# Altium project PrintingProjectAllDocs.PrjPCB (part 2 of 3)

## Sheet MicMixer.SchDoc: Microphone Mixer
size B; CompanyName: Smart Home; DrawnBy: Levi Balling; Engineer: Levi Balling; Organization: U of U Computer Engineering; Address1: 50 S Central Campus Dr.; Address2: Rm. 3280 MEB; Address3: SLC, UT 84112; DocumentNumber: 1; Revision: 1; SheetNumber: 12; SheetTotal: 13; Website: www.eng.utah.edu/~lballing/SmartHome; Project: Smart Home; DocumentName: Mic Mixer; ProjectName: Smart Home
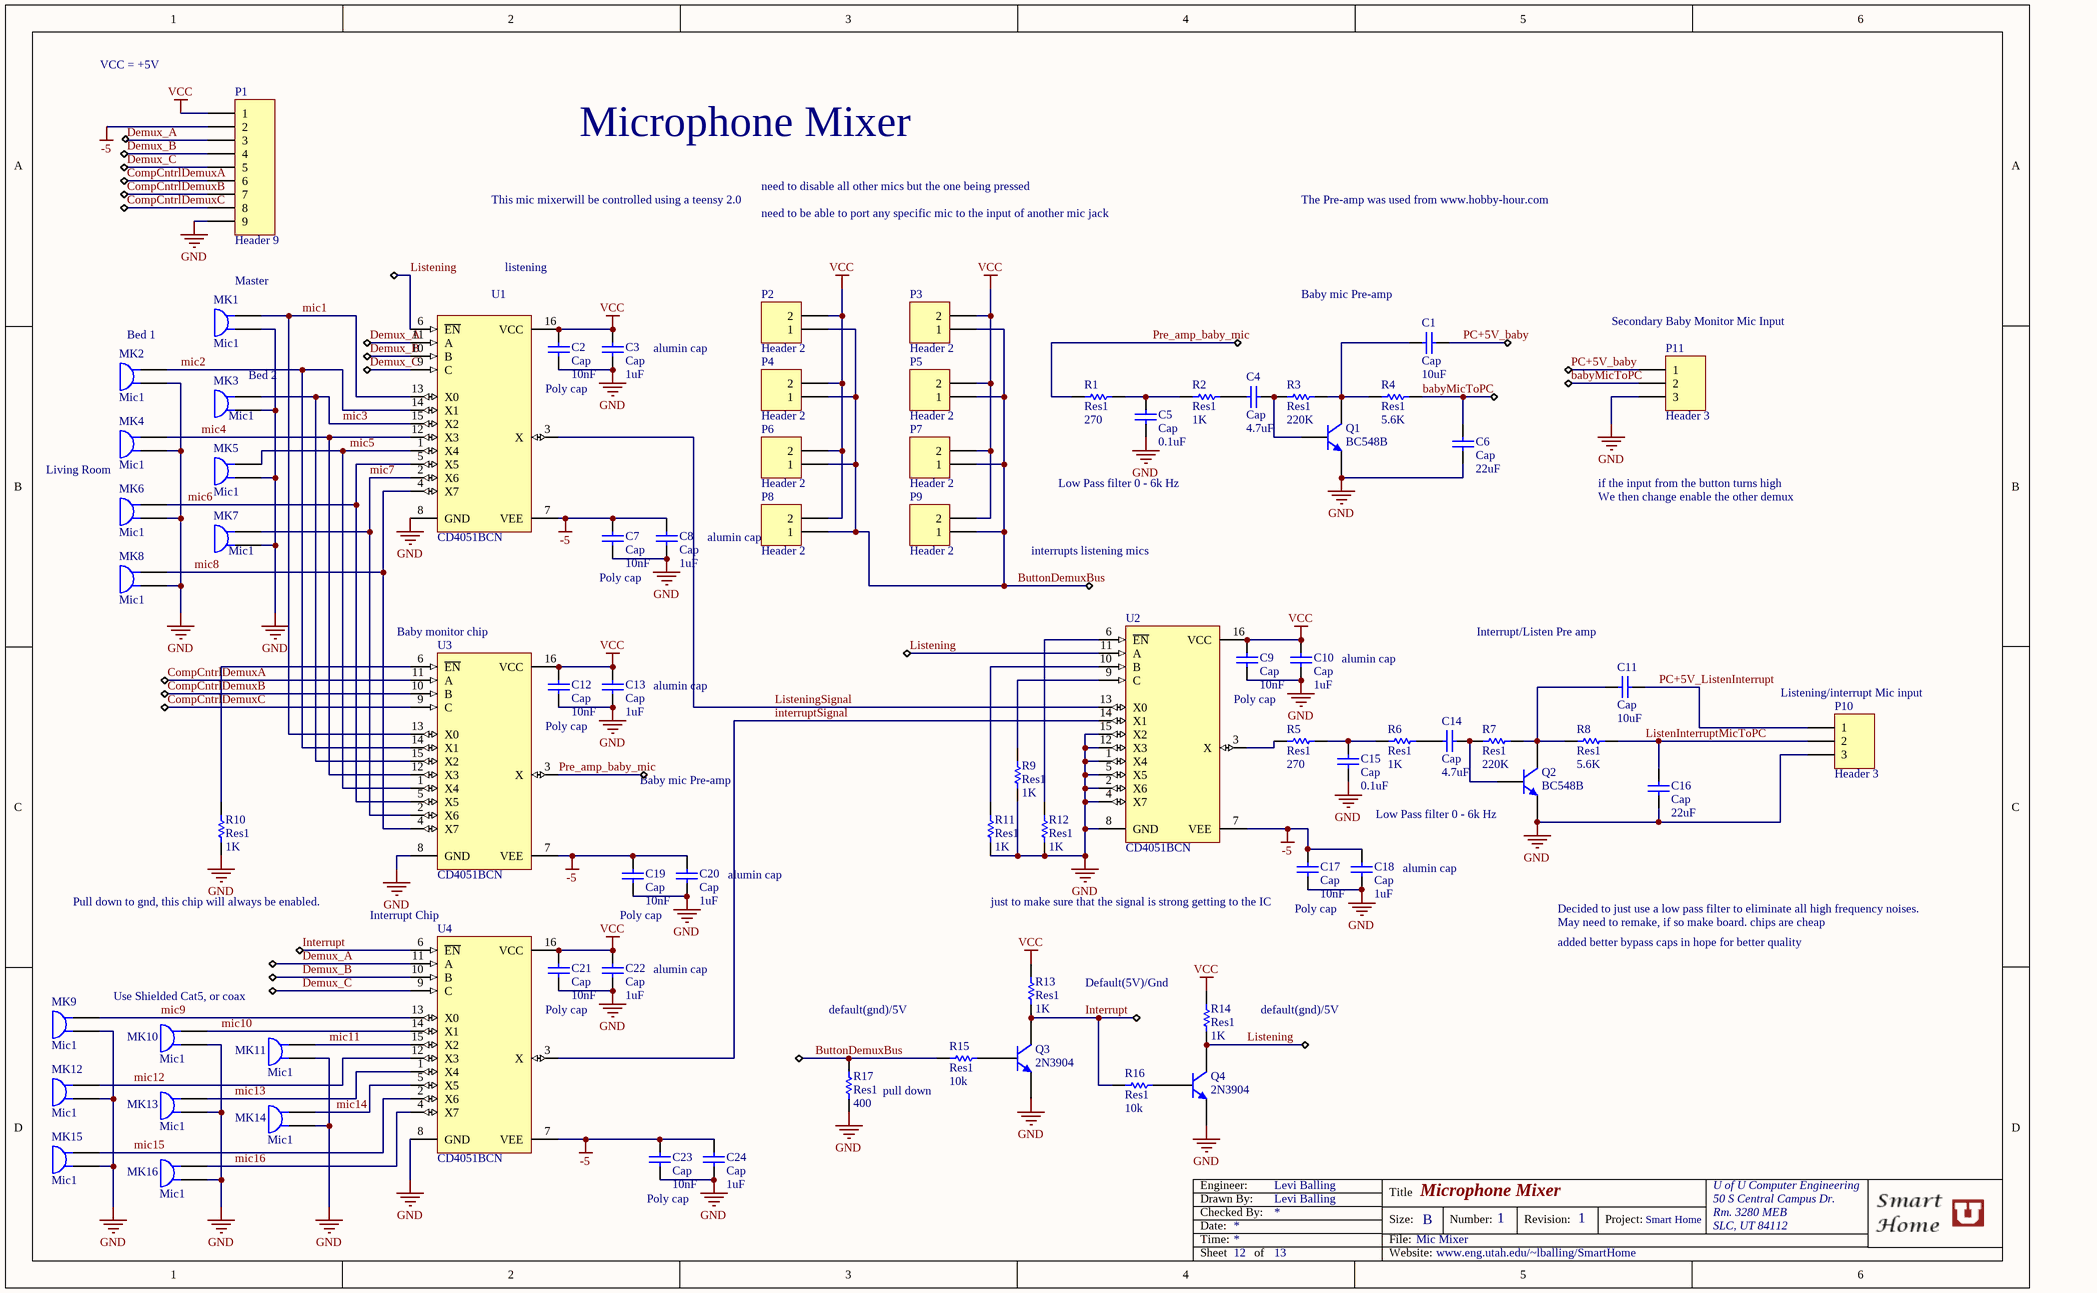
[diagram p5: MicMixer.SchDoc]

### Parts
(Parts that share a designator on the sheet are numbered #1, #2 ... from top to bottom, then left to right.)
C1#3  Cap  value 10uF  [RAD-0.2]
C2#3  Cap  value 10nF  [RAD-0.2]
C3#3  Cap  value 1uF  [RAD-0.2]
C4#3  Cap  value 4.7uF  [RAD-0.2]
C5#2  Cap  value 0.1uF  [RAD-0.2]
C6#2  Cap  value 22uF  [RAD-0.2]
C7#2  Cap  value 10nF  [RAD-0.2]
C8#2  Cap  value 1uF  [RAD-0.2]
C9#2  Cap  value 10nF  [RAD-0.2]
C10#1  Cap  value 1uF  [RAD-0.2]
C11#1  Cap  value 10uF  [RAD-0.2]
C12#1  Cap  value 10nF  [RAD-0.2]
C13#1  Cap  value 1uF  [RAD-0.2]
C14#1  Cap  value 4.7uF  [RAD-0.2]
C15#1  Cap  value 0.1uF  [RAD-0.2]
C16#1  Cap  value 22uF  [RAD-0.2]
C17#1  Cap  value 10nF  [RAD-0.2]
C18#1  Cap  value 1uF  [RAD-0.2]
C19#1  Cap  value 10nF  [RAD-0.2]
C20#1  Cap  value 1uF  [RAD-0.2]
C21#1  Cap  value 10nF  [RAD-0.2]
C22#1  Cap  value 1uF  [RAD-0.2]
C23#1  Cap  value 10nF  [RAD-0.2]
C24#1  Cap  value 1uF  [RAD-0.2]
MK1  Mic1  [PIN2]
MK2  Mic1  [PIN2]
MK3  Mic1  [PIN2]
MK4  Mic1  [PIN2]
MK5  Mic1  [PIN2]
MK6  Mic1  [PIN2]
MK7  Mic1  [PIN2]
MK8  Mic1  [PIN2]
MK9  Mic1  [PIN2]
MK10  Mic1  [PIN2]
MK11  Mic1  [PIN2]
MK12  Mic1  [PIN2]
MK13  Mic1  [PIN2]
MK14  Mic1  [PIN2]
MK15  Mic1  [PIN2]
MK16  Mic1  [PIN2]
P1#7  Header 9  [HDR1X9]
P2#9  Header 2  [HDR1X2]
P3#9  Header 2  [HDR1X2]
P4#7  Header 2  [HDR1X2]
P5#7  Header 2  [HDR1X2]
P6#4  Header 2  [HDR1X2]
P7#3  Header 2  [HDR1X2]
P8#2  Header 2  [HDR1X2]
P9#2  Header 2  [HDR1X2]
P10#3  Header 3  [HDR1X3]
P11#2  Header 3  [HDR1X3]
Q1#4  BC548B  [2N3904]
Q2#4  BC548B  [2N3904]
Q3#4  2N3904  [2N3904]
Q4#4  2N3904  [2N3904]
R1#4  Res1  value 270  [AXIAL-0.3]
R2#5  Res1  value 1K  [AXIAL-0.3]
R3#4  Res1  value 220K  [AXIAL-0.3]
R4#4  Res1  value 5.6K  [AXIAL-0.3]
R5#4  Res1  value 270  [AXIAL-0.3]
R6#3  Res1  value 1K  [AXIAL-0.3]
R7#3  Res1  value 220K  [AXIAL-0.3]
R8#3  Res1  value 5.6K  [AXIAL-0.3]
R9#3  Res1  value 1K  [AXIAL-0.3]
R10#3  Res1  value 1K  [AXIAL-0.3]
R11#3  Res1  value 1K  [AXIAL-0.3]
R12#3  Res1  value 1K  [AXIAL-0.3]
R13#3  Res1  value 1K  [AXIAL-0.3]
R14#3  Res1  value 1K  [AXIAL-0.3]
R15#3  Res1  value 10k  [AXIAL-0.3]
R16#3  Res1  value 10k  [AXIAL-0.3]
R17#3  Res1  value 400  [AXIAL-0.3]
U1#3  CD4051BCN  [N16E]
U2#3  CD4051BCN  [N16E]
U3#3  CD4051BCN  [N16E]
U4#3  CD4051BCN  [N16E]

### Nets
-5: C7#2.2 C8#2.2 C17#1.2 C18#1.2 C19#1.2 C20#1.2 C23#1.2 C24#1.2 P1#7.2 U1#3.7(VEE) U2#3.7(VEE) U3#3.7(VEE) U4#3.7(VEE)
GND: C2#3.1 C3#3.1 C5#2.2 C6#2.2 C7#2.1 C8#2.1 C9#2.1 C10#1.1 C12#1.1 C13#1.1 C15#1.2 C16#1.2 C17#1.1 C18#1.1 C19#1.1 C20#1.1 C21#1.1 C22#1.1 C23#1.1 C24#1.1 MK1.1 MK2.1 MK3.1 MK4.1 MK5.1 MK6.1 MK7.1 MK8.1 MK9.1 MK10.1 MK11.1 MK12.1 MK13.1 MK14.1 MK15.1 MK16.1 P1#7.9 P10#3.3 P11#2.3 Q1#4.1(E) Q2#4.1(E) Q3#4.1(E) Q4#4.1(E) R9#3.1 R10#3.1 R11#3.1 R12#3.1 R17#3.1 U1#3.8(GND) U2#3.1(X4) U2#3.2(X6) U2#3.4(X7) U2#3.5(X5) U2#3.8(GND) U2#3.12(X3) U2#3.15(X2) U3#3.8(GND) U4#3.8(GND)  [project net DampVCC12]
VCC: C2#3.2 C3#3.2 C9#2.2 C10#1.2 C12#1.2 C13#1.2 C21#1.2 C22#1.2 P1#7.1 P2#9.2 P3#9.2 P4#7.2 P5#7.2 P6#4.2 P7#3.2 P8#2.2 P9#2.2 R13#3.1 R14#3.1 U1#3.16(VCC) U2#3.16(VCC) U3#3.16(VCC) U4#3.16(VCC)
babyMicToPC: C6#2.1 P11#2.2 R4#4.2
ButtonDemuxBus: P2#9.1 P3#9.1 P4#7.1 P5#7.1 P6#4.1 P7#3.1 P8#2.1 P9#2.1 R15#3.2 R17#3.2
CompCntrlDemuxA: P1#7.6 U3#3.11(A)
CompCntrlDemuxB: P1#7.7 U3#3.10(B)
CompCntrlDemuxC: P1#7.8 U3#3.9(C)
Demux_A: P1#7.3 U1#3.11(A) U4#3.11(A)
Demux_B: P1#7.4 U1#3.10(B) U4#3.10(B)
Demux_C: P1#7.5 U1#3.9(C) U4#3.9(C)
Interrupt: Q3#4.3(C) R13#3.2 R16#3.2 U4#3.6(~{EN})
interruptSignal: U2#3.14(X1) U4#3.3(X)
Listening: Q4#4.3(C) R14#3.2 U1#3.6(~{EN}) U2#3.11(A)
ListeningSignal: U1#3.3(X) U2#3.13(X0)
ListenInterruptMicToPC: C16#1.1 P10#3.2 R8#3.2
mic1: MK1.2 U1#3.13(X0) U3#3.13(X0)
mic2: MK2.2 U1#3.14(X1) U3#3.14(X1)
mic3: MK3.2 U1#3.15(X2) U3#3.15(X2)
mic4: MK4.2 U1#3.12(X3) U3#3.12(X3)
mic5: MK5.2 U1#3.1(X4) U3#3.1(X4)
mic6: MK6.2 U1#3.5(X5) U3#3.5(X5)
mic7: MK7.2 U1#3.2(X6) U3#3.2(X6)
mic8: MK8.2 U1#3.4(X7) U3#3.4(X7)
mic9: MK9.2 U4#3.13(X0)
mic10: MK10.2 U4#3.14(X1)
mic11: MK11.2 U4#3.15(X2)
mic12: MK12.2 U4#3.12(X3)
mic13: MK13.2 U4#3.1(X4)
mic14: MK14.2 U4#3.5(X5)
mic15: MK15.2 U4#3.2(X6)
mic16: MK16.2 U4#3.4(X7)
PC+5V_baby: C1#3.2 P11#2.1
PC+5V_ListenInterrupt: C11#1.2 P10#3.1
Pre_amp_baby_mic: R1#4.1 U3#3.3(X)
NetC1#3_1: C1#3.1 Q1#4.3(C) R3#4.2 R4#4.1
NetC4#3_1: C4#3.1 Q1#4.2(B) R3#4.1
NetC4#3_2: C4#3.2 R2#5.2
NetC5#2_1: C5#2.1 R1#4.2 R2#5.1
NetC11#1_1: C11#1.1 Q2#4.3(C) R7#3.2 R8#3.1
NetC14#1_1: C14#1.1 Q2#4.2(B) R7#3.1
NetC14#1_2: C14#1.2 R6#3.2
NetC15#1_1: C15#1.1 R5#4.2 R6#3.1
NetQ3#4_2: Q3#4.2(B) R15#3.1
NetQ4#4_2: Q4#4.2(B) R16#3.1
NetR5#4_1: R5#4.1 U2#3.3(X)
NetR9#3_2: R9#3.2 U2#3.9(C)
NetR10#3_2: R10#3.2 U3#3.6(~{EN})
NetR11#3_2: R11#3.2 U2#3.10(B)
NetR12#3_2: R12#3.2 U2#3.6(~{EN})

### Notes on the sheet
- VCC = +5V
- This mic mixerwill be controlled using a teensy 2.0
- need to disable all other mics but the one being pressed
- need to be able to port any specific mic to the input of another mic jack
- The Pre-amp was used from www.hobby-hour.com
- (near MK1) Master
- listening
- (near C1#3) Baby mic Pre-amp
- (near MK2) Bed 1
- (near C3#3) alumin cap
- (near P11#2) Secondary Baby Monitor Mic Input
- (near MK3) Bed 2
- (near U1#3) Poly cap
- Living Room
- Low Pass filter 0 - 6k Hz
- if the input from the button turns high
- We then change enable the other demux
- alumin cap
- interrupts listening mics
- (near U3#3) Baby monitor chip
- Poly cap
- (near C11#1) Interrupt/Listen Pre amp
- (near C13#1) alumin cap
- (near U2#3) Poly cap
- (near C10#1) alumin cap
- (near P10#3) Listening/interrupt Mic input
- (near U3#3) Poly cap
- Baby mic Pre-amp
- (near Q2#4) Low Pass filter 0 - 6k Hz
- Pull down to gnd, this chip will always be enabled.
- (near C20#1) alumin cap
- just to make sure that the signal is strong getting to the IC
- (near C18#1) alumin cap
- Decided to just use a low pass filter to eliminate all high frequency noises.
- (near U4#3) Interrupt Chip
- (near C22#1) alumin cap
- May need to remake, if so make board. chips are cheap
- added better bypass caps in hope for better quality
- Use Shielded Cat5, or coax
- (near U4#3) Poly cap
- default(gnd)/5V
- (near R14#3) Default(5V)/Gnd
- pull down
- Date:
- Time:
- Engineer:
- Drawn By:
- Checked By:
- Title
- Size:
- File:
- B
- Number:
- Revision:
- Project:
- Sheet
- of
- Website:

### Library data of the parts
C1#3 C2#3 C3#3 C4#3 C5#2 C6#2 C7#2 C8#2 C9#2 C10#1 C11#1 C12#1 C13#1 C14#1 C15#1 C16#1 C17#1 C18#1 C19#1 C20#1 C21#1 C22#1 C23#1 C24#1 = Cap: Capacitor; Vendor: Taydaelectronics; Published: 8-Jun-2000; LatestRevisionDate: 17-Jul-2002; LatestRevisionNote: Re-released for DXP Platform.; PackageReference: RAD-0.3; Publisher: Altium Limited; PackageDescription: Radial Cap, Thru-Hole; 2 Leads; 0.3 in Pin Spacing
  C1#3 C3#3 C4#3 C5#2 C6#2 C8#2 C10#1 C11#1 C13#1 C14#1 C15#1 C16#1 C18#1 C20#1 C22#1 C24#1: Price: 0.03
  C2#3 C7#2 C9#2 C12#1 C17#1 C19#1 C21#1 C23#1: Price: 0.04
MK1-MK16 = Mic1: Microphone; Vendor: Taydaelectronics; Published: 24-Mar-1999; LatestRevisionDate: 17-Jul-2002; LatestRevisionNote: Re-released for DXP Platform.; PackageReference: PIN2; Publisher: Altium Limited; Price: 0.25; Value: Mic1
P1#7 = Header 9: Header, 9-Pin; Vendor: Taydaelectronics; LatestRevisionDate: 17-Jul-2002; LatestRevisionNote: Re-released for DXP Platform.; Publisher: Altium Limited; Price: 0.09; Value: Header 9
P2#9 P3#9 P4#7 P5#7 P6#4 P7#3 P8#2 P9#2 = Header 2: Header, 2-Pin; Vendor: Taydaelectronics; LatestRevisionDate: 17-Jul-2002; LatestRevisionNote: Re-released for DXP Platform.; Publisher: Altium Limited; Price: 0.02; Value: Header 2
P10#3 P11#2 = Header 3: Header, 3-Pin; Vendor: Taydaelectronics; LatestRevisionDate: 17-Jul-2002; LatestRevisionNote: Re-released for DXP Platform.; Publisher: Altium Limited; Price: 0.03; Value: Header 3
Q1#4 Q2#4 Q3#4 Q4#4 = 2N3904: as Q1#1 on sheet DamperSection; Published: 8-Jun-2000; LatestRevisionDate: 15-Jan-2003; LatestRevisionNote: PCB Footprint 'BCY-W3/D4.7' replaced; DatasheetVersion: 1997; PackageVersion: Sep-1998; PackageReference: TO-92A; Publisher: Altium Limited; PackageDescription: TO, Flat Index; 3 In-Line, Axial Leads; Body Dia. 4.5mm; Leads 0.51 x 0.48 mm (max); ComponentLink1URL: http://www.fairchildsemi.com/; ComponentLink2Description: Datasheet; ComponentLink2URL: http://www.fairchildsemi.com/ds/2N%2F2N3904.pdf; Price: 0.01
  Q1#4 Q2#4: Value: BC548B
  Q3#4 Q4#4: Value: 2N3904
R1#4 R2#5 R3#4 R4#4 R5#4 R6#3 R7#3 R8#3 R9#3 R10#3 R11#3 R12#3 R13#3 R14#3 R15#3 R16#3 R17#3 = Res1: Resistor; Vendor: Taydaelectronics; Published: 8-Jun-2000; LatestRevisionDate: 17-Jul-2002; LatestRevisionNote: Re-released for DXP Platform.; PackageReference: AXIAL-0.3; Publisher: Altium Limited; PackageDescription: Axial Device, Thru-Hole; 2 Leads; 0.3 in Pin Spacing; Price: 0.01
U1#3 U2#3 U3#3 U4#3 = CD4051BCN: 8-Channel Analog Multiplexer/Demultiplexer; Vendor: Taydaelectronics; Published: 17-Jul-2002; LatestRevisionDate: 29-May-2009; LatestRevisionNote: Component Body Added.; DatasheetVersion: Jan-1999; PackageVersion: 2000; PackageReference: N16E; Publisher: Altium Limited; PackageDescription: DIP, 16-Pin, Row Spacing 7.62 mm, Pitch 2.54 mm; ComponentLink1URL: http://www.fairchildsemi.com/; ComponentLink2Description: Datasheet; ComponentLink2URL: http://www.fairchildsemi.com/ds/CD%2FCD4052BC.pdf; Price: 0.23; Value: CD4051BCN

## Sheet MotorController.SchDoc: Bi-Polar Stepper Motor Driver
size B; Date: 7/13/2012; ApprovedBy: Levi Balling; CheckedBy: Dell Hanks; Author: Rob Paisley; CompanyName: Smart Home; DrawnBy: Levi Balling; Engineer: R. Paisley, L. Balling; Organization: U of U Computer Engineering; Address1: 50 S Central Campus Dr.; Address2: Rm. 3280 MEB; Address3: SLC,UT 84112; DocumentNumber: 1; Revision: 1; SheetNumber: 7; SheetTotal: 13; Project: Smart Home; Website: www.eng.utah.edu/~lballing/SmartHome; Description: This Board will control the bi-polar stepper motor with a range of 0.5 to 5 amps (provided you put heat sinks on); CurrentTime: 6:23PM; CurrentDate: 7/13/2012; DocumentName: Bi-Polar Stepper Motor Driver; ProjectName: Smart Home
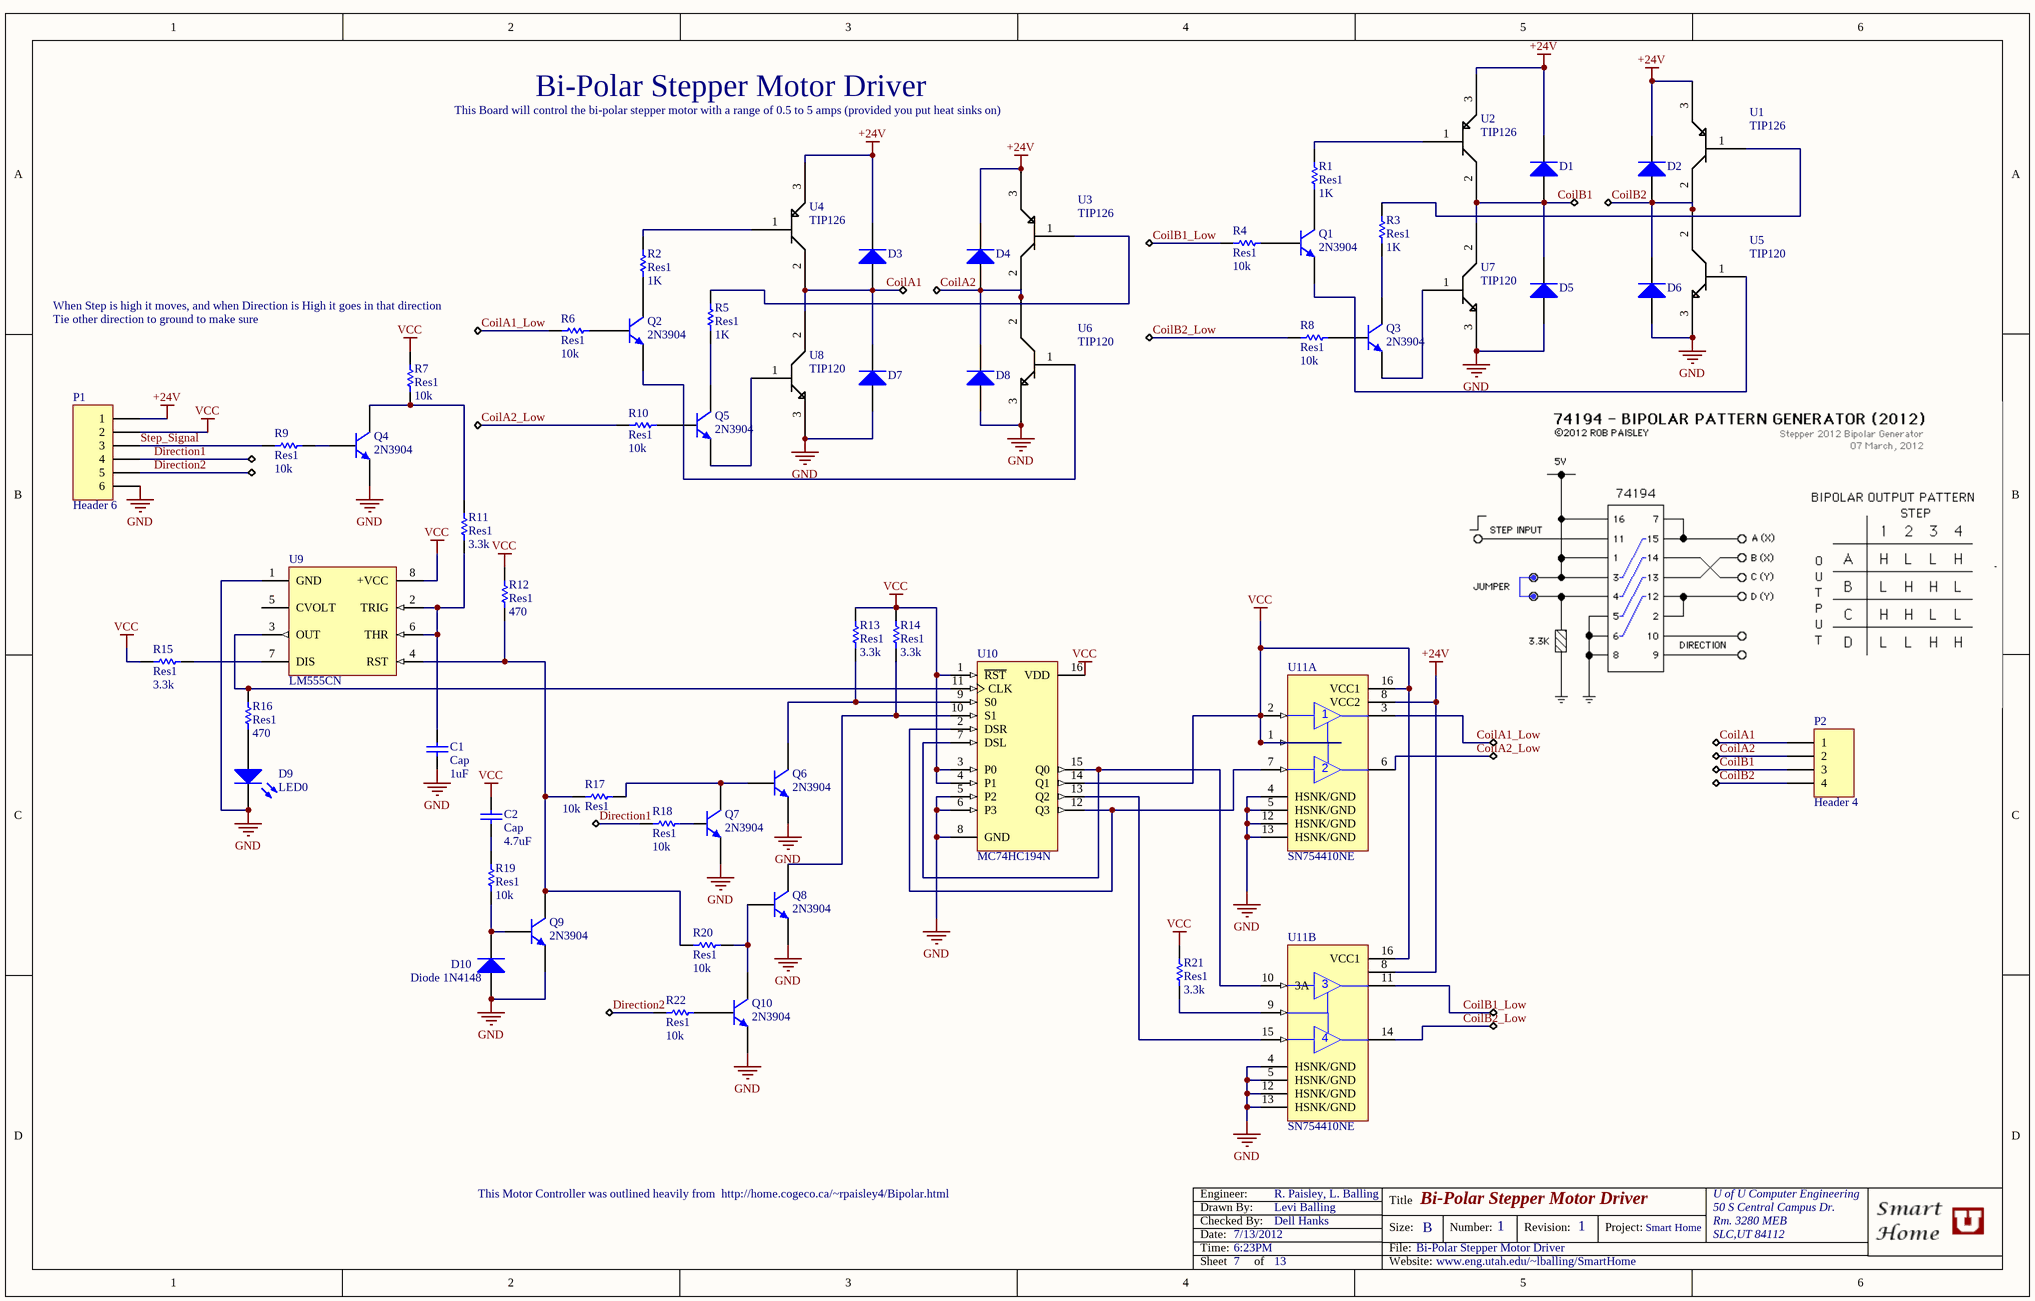
[diagram p6: MotorController.SchDoc]

### Parts
(Parts that share a designator on the sheet are numbered #1, #2 ... from top to bottom, then left to right.)
C1#4  Cap  value 1uF  [RAD-0.3]
C2#4  Cap  value 4.7uF  [RAD-0.3]
D1#4  Diode 1N5408  [DO-201AD]  (value not drawn)
D2#5  Diode 1N5408  [DO-201AD]  (value not drawn)
D3#4  Diode 1N5408  [DO-201AD]  (value not drawn)
D4#4  Diode 1N5408  [DO-201AD]  (value not drawn)
D5#4  Diode 1N5408  [DO-201AD]  (value not drawn)
D6#4  Diode 1N5408  [DO-201AD]  (value not drawn)
D7#4  Diode 1N5408  [DO-201AD]  (value not drawn)
D8#3  Diode 1N5408  [DO-201AD]  (value not drawn)
D9#2  LED0  [LED-0]
D10#2  Diode 1N4148  [DO-35]
P1#8  Header 6  [HDR1X6]
P2#10  Header 4  [HDR1X4]
Q1#5  2N3904  [2N3904]
Q2#5  2N3904  [2N3904]
Q3#5  2N3904  [2N3904]
Q4#5  2N3904  [2N3904]
Q5#4  2N3904  [2N3904]
Q6#3  2N3904  [2N3904]
Q7#3  2N3904  [2N3904]
Q8#2  2N3904  [2N3904]
Q9#2  2N3904  [2N3904]
Q10#2  2N3904  [2N3904]
R1#5  Res1  value 1K  [AXIAL-0.3]
R2#6  Res1  value 1K  [AXIAL-0.3]
R3#5  Res1  value 1K  [AXIAL-0.3]
R4#5  Res1  value 10k  [AXIAL-0.3]
R5#5  Res1  value 1K  [AXIAL-0.3]
R6#4  Res1  value 10k  [AXIAL-0.3]
R7#4  Res1  value 10k  [AXIAL-0.3]
R8#4  Res1  value 10k  [AXIAL-0.3]
R9#4  Res1  value 10k  [AXIAL-0.3]
R10#4  Res1  value 10k  [AXIAL-0.3]
R11#4  Res1  value 3.3k  [AXIAL-0.3]
R12#4  Res1  value 470  [AXIAL-0.3]
R13#4  Res1  value 3.3k  [AXIAL-0.3]
R14#4  Res1  value 3.3k  [AXIAL-0.3]
R15#4  Res1  value 3.3k  [AXIAL-0.3]
R16#4  Res1  value 470  [AXIAL-0.3]
R17#4  Res1  value 10k  [AXIAL-0.3]
R18#3  Res1  value 10k  [AXIAL-0.3]
R19#3  Res1  value 10k  [AXIAL-0.3]
R20#3  Res1  value 10k  [AXIAL-0.3]
R21#3  Res1  value 3.3k  [AXIAL-0.3]
R22#3  Res1  value 10k  [AXIAL-0.3]
U1#4  TIP126  [TO-220]
U2#4  TIP126  [TO-220]
U3#4  TIP126  [TO-220]
U4#4  TIP126  [TO-220]
U5#2  TIP120  [TO-220]
U6#1  TIP120  [TO-220]
U7  TIP120  [TO-220]
U8  TIP120  [TO-220]
U9  LM555CN  [N08E]
U10  MC74HC194N  [648-06]
U11  SN754410NE  [NE016]  (parts A,B of 2)

### Nets
+24V: D1#4.2(K) D2#5.2(K) D3#4.2(K) D4#4.2(K) P1#8.1 U1#4.3 U2#4.3 U3#4.3 U4#4.3 U11.8(VCC2)
GND: C1#4.2 D5#4.1(A) D6#4.1(A) D7#4.1(A) D8#3.1(A) D9#2.2(K) D10#2.1(A) P1#8.6 Q4#5.1(E) Q6#3.1(E) Q7#3.1(E) Q8#2.1(E) Q9#2.1(E) Q10#2.1(E) U5#2.3 U6#1.3 U7.3 U8.3 U9.1(GND) U10.5(P2) U10.6(P3) U10.8(GND) U11.4(HSNK/GND) U11.5(HSNK/GND) U11.12(HSNK/GND) U11.13(HSNK/GND)  [project net DampVCC12]
VCC: C2#4.1 P1#8.2 R7#4.2 R12#4.1 R13#4.1 R14#4.1 R15#4.2 R21#3.1 U9.8(+VCC) U10.1(~{RST}) U10.3(P0) U10.4(P1) U10.14(Q1) U10.16(VDD) U11.1(1,2EN) U11.2(1A) U11.16(VCC1)
CoilA1: D3#4.1(A) D7#4.2(K) P2#10.1 U4#4.2 U8.2
CoilA1_Low: R6#4.1 U11.3(1Y)
CoilA2: D4#4.1(A) D8#3.2(K) P2#10.2 U3#4.2 U6#1.2
CoilA2_Low: R10#4.1 U11.6(2Y)
CoilB1: D1#4.1(A) D5#4.2(K) P2#10.3 U2#4.2 U7.2
CoilB1_Low: R4#5.1 U11.11(3Y)
CoilB2: D2#5.1(A) D6#4.2(K) P2#10.4 U1#4.2 U5#2.2
CoilB2_Low: R8#4.1 U11.14(4Y)
Direction1: P1#8.4 R18#3.2
Direction2: P1#8.5 R22#3.2
Step_Signal: P1#8.3 R9#4.2
NetC1#4_1: C1#4.1 R11#4.1 U9.2(TRIG) U9.6(THR)
NetC2#4_2: C2#4.2 R19#3.1
NetD9#2_1: D9#2.1(A) R16#4.2
NetD10#2_2: D10#2.2(K) Q9#2.2(B) R19#3.2
NetQ1#5_1: Q1#5.1(E) U5#2.1
NetQ1#5_2: Q1#5.2(B) R4#5.2
NetQ1#5_3: Q1#5.3(C) R1#5.1
NetQ2#5_1: Q2#5.1(E) U6#1.1
NetQ2#5_2: Q2#5.2(B) R6#4.2
NetQ2#5_3: Q2#5.3(C) R2#6.1
NetQ3#5_1: Q3#5.1(E) U7.1
NetQ3#5_2: Q3#5.2(B) R8#4.2
NetQ3#5_3: Q3#5.3(C) R3#5.1
NetQ4#5_2: Q4#5.2(B) R9#4.1
NetQ4#5_3: Q4#5.3(C) R7#4.1 R11#4.2
NetQ5#4_1: Q5#4.1(E) U8.1
NetQ5#4_2: Q5#4.2(B) R10#4.2
NetQ5#4_3: Q5#4.3(C) R5#5.1
NetQ6#3_2: Q6#3.2(B) Q7#3.3(C) R17#4.2
NetQ6#3_3: Q6#3.3(C) R13#4.2 U10.9(S0)
NetQ7#3_2: Q7#3.2(B) R18#3.1
NetQ8#2_2: Q8#2.2(B) Q10#2.3(C) R20#3.2
NetQ8#2_3: Q8#2.3(C) R14#4.2 U10.10(S1)
NetQ9#2_3: Q9#2.3(C) R12#4.2 R17#4.1 R20#3.1 U9.4(RST)
NetQ10#2_2: Q10#2.2(B) R22#3.1
NetR1#5_2: R1#5.2 U2#4.1
NetR2#6_2: R2#6.2 U4#4.1
NetR3#5_2: R3#5.2 U1#4.1
NetR5#5_2: R5#5.2 U3#4.1
NetR15#4_1: R15#4.1 U9.7(DIS)
NetR16#4_1: R16#4.1 U9.3(OUT) U10.11(CLK)
NetR21#3_2: R21#3.2 U11.9(3,4EN)
NetU10_2: U10.2(DSR) U10.12(Q3) U11.7(2A)
NetU10_7: U10.7(DSL) U10.15(Q0) U11.10(3A)
NetU10_13: U10.13(Q2) U11.15(4A)

Not connected (* = marked no-connect by the designer): U9 5(CVOLT)

### Notes on the sheet
- (near R6#4) When Step is high it moves, and when Direction is High it goes in that direction
- Tie other direction to ground to make sure
- This Motor Controller was outlined heavily from  http://home.cogeco.ca/~rpaisley4/Bipolar.html
- Date:
- Time:
- Engineer:
- Drawn By:
- Checked By:
- Title
- Size:
- File:
- B
- Number:
- Revision:
- Project:
- Sheet
- of
- Website:

### Library data of the parts
C1#4 C2#4 = Cap: Capacitor; Vendor: Taydaelectronics; Published: 8-Jun-2000; LatestRevisionDate: 17-Jul-2002; LatestRevisionNote: Re-released for DXP Platform.; PackageReference: RAD-0.3; Publisher: Altium Limited; PackageDescription: Radial Cap, Thru-Hole; 2 Leads; 0.3 in Pin Spacing; Price: 0.03
D1#4 D2#5 D3#4 D4#4 D5#4 D6#4 D7#4 D8#3 = Diode 1N5408: 3 Amp Medium Power Silicon Rectifier Diode; Vendor: Taydaelectronics; Published: 8-Jun-2000; LatestRevisionDate: 17-Jul-2002; LatestRevisionNote: Re-released for DXP Platform.; DatasheetVersion: Aug-1984; PackageReference: DO-201AD; Publisher: Altium Limited; PackageDescription: Diode, Axial; Body 9.5 x 5.3 mm (LxDia. max), Lead Dia. 1.32 mm (max); ComponentLink1URL: http://www.irf.com/; Price: 0.03; Value: Diode 1N5408
D9#2 = LED0: Typical INFRARED GaAs LED; Vendor: Taydaelectronics; Published: 8-Jun-2000; LatestRevisionDate: 08-Jul-2005; LatestRevisionNote: Mech Layer 1 removed.; PackageReference: LED-0; Publisher: Altium Limited; PackageDescription: LED; 2 Leads; Price: 0.04; Value: LED0
D10#2 = Diode 1N4148: High Conductance Fast Diode; Vendor: Taydaelectronics; Published: 8-Jun-2000; LatestRevisionDate: 17-Jul-2002; LatestRevisionNote: Re-released for DXP Platform.; DatasheetVersion: 1997; PackageReference: DO-35; Publisher: Altium Limited; PackageDescription: Diode, Axial; Body 3.8 x 1.9 mm (LxDia. max), Lead Dia. 0.53 mm (max); Code_JEDEC: DO-204-AH; ComponentLink1URL: http://www.fairchildsemi.com/; ComponentLink2Description: Datasheet; ComponentLink2URL: http://www.fairchildsemi.com/ds/1N%2F1N4148.pdf; Price: 0.01; Value: Diode 1N4148
P1#8 = Header 6: Header, 6-Pin; Vendor: Taydaelectronics; LatestRevisionDate: 17-Jul-2002; LatestRevisionNote: Re-released for DXP Platform.; Publisher: Altium Limited; Price: 0.06; Value: Header 6
P2#10 = Header 4: Header, 4-Pin; Vendor: Taydaelectronics; LatestRevisionDate: 17-Jul-2002; LatestRevisionNote: Re-released for DXP Platform.; Publisher: Altium Limited; Price: 0.04; Value: Header 4
Q1#5 Q2#5 Q3#5 Q4#5 Q5#4 Q6#3 Q7#3 Q8#2 Q9#2 Q10#2 = 2N3904: as Q1#1 on sheet DamperSection; Published: 8-Jun-2000; LatestRevisionDate: 15-Jan-2003; LatestRevisionNote: PCB Footprint 'BCY-W3/D4.7' replaced; DatasheetVersion: 1997; PackageVersion: Sep-1998; PackageReference: TO-92A; Publisher: Altium Limited; PackageDescription: TO, Flat Index; 3 In-Line, Axial Leads; Body Dia. 4.5mm; Leads 0.51 x 0.48 mm (max); ComponentLink1URL: http://www.fairchildsemi.com/; ComponentLink2Description: Datasheet; ComponentLink2URL: http://www.fairchildsemi.com/ds/2N%2F2N3904.pdf; Price: 0.01; Value: 2N3904
R1#5 R2#6 R3#5 R4#5 R5#5 R6#4 R7#4 R8#4 R9#4 R10#4 R11#4 R12#4 R13#4 R14#4 R15#4 R16#4 R17#4 R18#3 R19#3 R20#3 R21#3 R22#3 = Res1: Resistor; Vendor: Taydaelectronics; Published: 8-Jun-2000; LatestRevisionDate: 17-Jul-2002; LatestRevisionNote: Re-released for DXP Platform.; PackageReference: AXIAL-0.3; Publisher: Altium Limited; PackageDescription: Axial Device, Thru-Hole; 2 Leads; 0.3 in Pin Spacing; Price: 0.01
U1#4 U2#4 U3#4 U4#4 = TIP126: TIP126 -PNP; Vendor: Taydaelectronics; Price: 0.35; Value: TIP126
U5#2 U6#1 U7 U8 = TIP120: NPN 60V -5A TO-220; Vendor: Taydaelectronics; Price: 0.26; Value: TIP120
U9 = LM555CN: Timer; Manufacturer: National Semiconductor; CompType: Analog IC; PackageTopMarking: NSUZXYTT*LM*555CN; PowerWise: N; Vendor: Taydaelectronics; Published: 4-Dec-2008; DatasheetVersion: Jul-2006; PackageVersion: revG, May-2006; PackageReference: N08E; Publisher: Altium Limited; PackageDescription: MDIP, .365 x .250 x .130in, 8 Lead, .100in Pitch; PartNumber: LM555CN; PinCount: 8; DigiKeyPartNumber: LM555CNNS-ND; Code_JEDEC: MS-001-BA; ComponentLink1URL: http://www.national.com/ds.cgi/LM/LM555.pdf; ComponentLink2Description: LM555 Web Page; ComponentLink2URL: http://www.national.com/pf/LM/LM555.html; ComponentLink3Description: N08E package page; ComponentLink3URL: http://www.national.com/packaging/folders/n08e.html; Price: 0.14; Value: LM555CN
U10 = MC74HC194N: 4-Bit Bidirectional Universal Shift Register; Vendor: Digi-Key; Published: 17-Jul-2002; LatestRevisionDate: 06-Jun-2005; LatestRevisionNote: Stylized 3D Model Added; DatasheetVersion: 1989; PackageReference: 648-06; Publisher: Altium Limited; PackageDescription: DIP; 16 Leads; Row Spacing 7.62 mm; Pitch 2.54 mm; ComponentLink1URL: http://www.onsemi.com/site/products/parametrics/0,4446,557,00.html; Price: 0.68; Value: MC74HC194N
U11 = SN754410NE: Quadruple Half-H Driver; Vendor: U of U; Published: 15-May-2002; LatestRevisionDate: 29-May-2009; LatestRevisionNote: Component Body Added.; DatasheetVersion: May-1990; PackageVersion: 1991; PackageReference: NE016; Publisher: Altium Limited; PackageDescription: DIP, 16-Pin, Row Spacing 7.62 mm, Pitch 2.54 mm; Code_JEDEC: MS-001-BB; ComponentLink1URL: http://www.ti.com/; ComponentLink2Description: Datasheet; ComponentLink2URL: http://www-s.ti.com/sc/ds/sn754410.pdf; Price: 0.00; Value: SN754410NE

## Sheet PowerAndFanBoard.SchDoc: Epic Cube Power Supply
size B; DrawnBy: Levi Balling; Engineer: Levi Balling; Organization: U of U Computer Engineering; Address1: 50 S. Central Campus Dr.; Address2: Rm. 3280 MEB; Address3: Salt Lake City, UT; Address4: Australia 2086; DocumentNumber: 1; Revision: 1; SheetNumber: 5; SheetTotal: 13; Website: www.eng.utah.edu/~lballing/SmartHome; Project: Smart Home; Description: This Board will provide power to the rest of the Epic Cube( power is supplied by a 24V 4.5A power supply); ProjectName: Smart Home
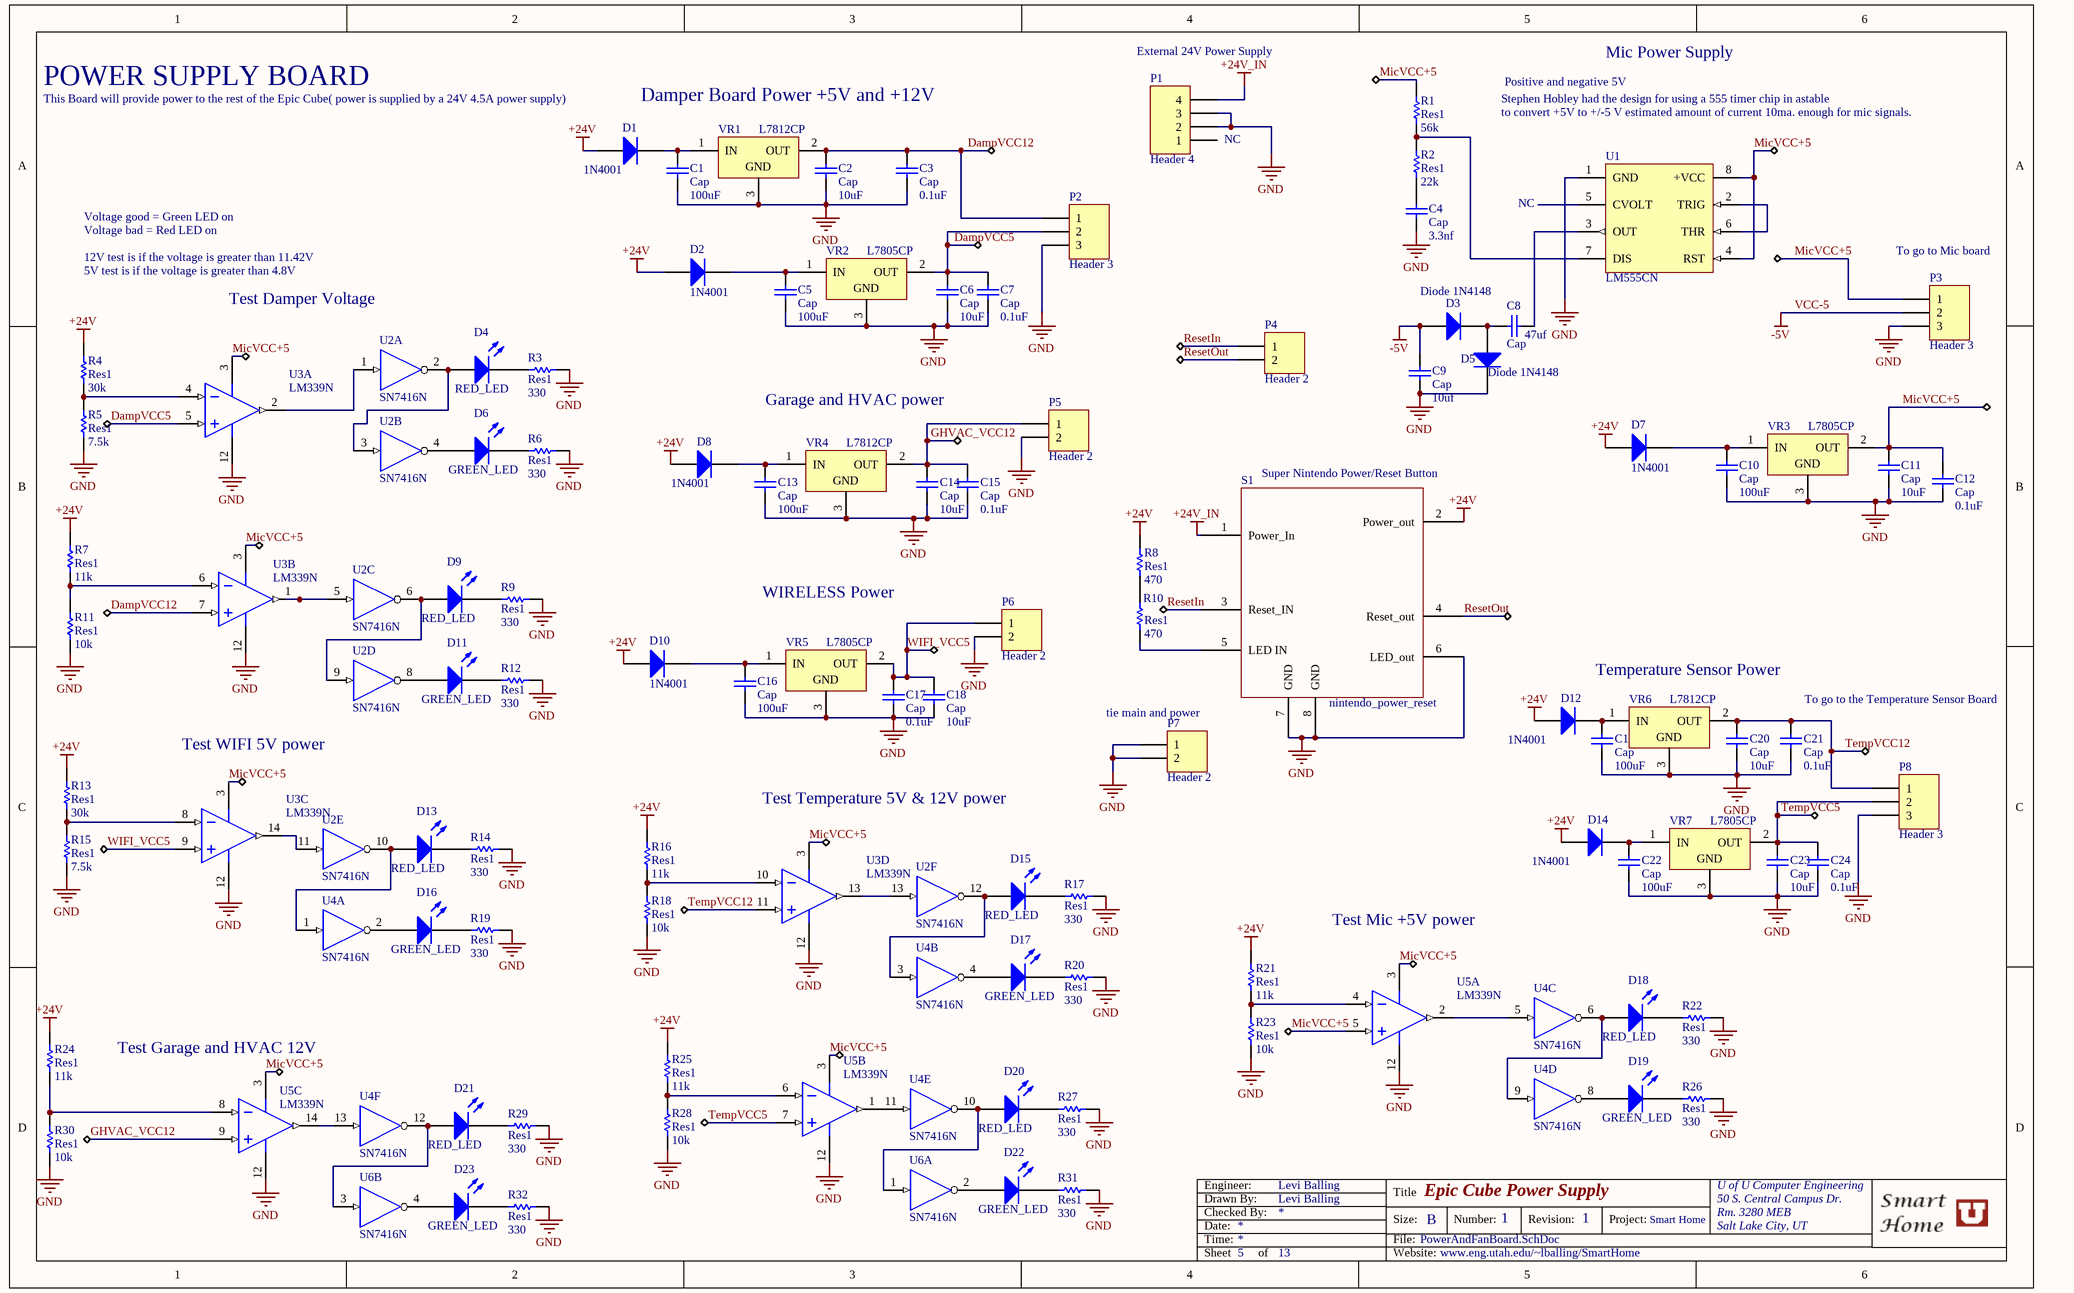
[diagram p7: PowerAndFanBoard.SchDoc]

### Parts
(Parts that share a designator on the sheet are numbered #1, #2 ... from top to bottom, then left to right.)
C1#5  Cap  value 100uF  [RAD-0.3]
C2#5  Cap  value 10uF  [RAD-0.3]
C3#4  Cap  value 0.1uF  [RAD-0.3]
C4#4  Cap  value 3.3nf  [RAD-0.3]
C5#3  Cap  value 100uF  [RAD-0.3]
C6#3  Cap  value 10uF  [RAD-0.3]
C7#3  Cap  value 0.1uF  [RAD-0.3]
C8#3  Cap  value 47uf  [RAD-0.3]
C9#3  Cap  value 10uf  [RAD-0.3]
C10#2  Cap  value 100uF  [RAD-0.3]
C11#2  Cap  value 10uF  [RAD-0.3]
C12#2  Cap  value 0.1uF  [RAD-0.3]
C13#2  Cap  value 100uF  [RAD-0.3]
C14#2  Cap  value 10uF  [RAD-0.3]
C15#2  Cap  value 0.1uF  [RAD-0.3]
C16#2  Cap  value 100uF  [RAD-0.3]
C17#2  Cap  value 0.1uF  [RAD-0.3]
C18#2  Cap  value 10uF  [RAD-0.3]
C19#2  Cap  value 100uF  [RAD-0.3]
C20#2  Cap  value 10uF  [RAD-0.3]
C21#2  Cap  value 0.1uF  [RAD-0.3]
C22#2  Cap  value 100uF  [RAD-0.3]
C23#2  Cap  value 10uF  [RAD-0.3]
C24#2  Cap  value 0.1uF  [RAD-0.3]
D1#5  1N4001  [DO-41]
D2#6  1N4001  [DO-41]
D3#5  Diode 1N4148  [DO-35]
D4#5  RED_LED  [LED]
D5#5  Diode 1N4148  [DO-35]
D6#5  GREEN_LED  [LED]
D7#5  1N4001  [DO-41]
D8#4  1N4001  [DO-41]
D9#3  RED_LED  [LED]
D10#3  1N4001  [DO-41]
D11#2  GREEN_LED  [LED]
D12#1  1N4001  [DO-41]
D13  RED_LED  [LED]
D14  1N4001  [DO-41]
D15  RED_LED  [LED]
D16  GREEN_LED  [LED]
D17  GREEN_LED  [LED]
D18  RED_LED  [LED]
D19  GREEN_LED  [LED]
D20  RED_LED  [LED]
D21  RED_LED  [LED]
D22  GREEN_LED  [LED]
D23  GREEN_LED  [LED]
P1#9  Header 4  [MainPowerConnector]
P2#11  Header 3  [HDR1X3]
P3#10  Header 3  [HDR1X3]
P4#8  Header 2  [HDR1X2]
P5#8  Header 2  [HDR1X2]
P6#5  Header 2  [HDR1X2]
P7#4  Header 2  [HDR1X2]
P8#3  Header 3  [HDR1X3]
R1#6  Res1  value 56k  [AXIAL-0.3]
R2#7  Res1  value 22k  [AXIAL-0.3]
R3#6  Res1  value 330  [AXIAL-0.3]
R4#6  Res1  value 30k  [AXIAL-0.3]
R5#6  Res1  value 7.5k  [AXIAL-0.3]
R6#5  Res1  value 330  [AXIAL-0.3]
R7#5  Res1  value 11k  [AXIAL-0.3]
R8#5  Res1  value 470  [AXIAL-0.3]
R9#5  Res1  value 330  [AXIAL-0.3]
R10#5  Res1  value 470  [AXIAL-0.3]
R11#5  Res1  value 10k  [AXIAL-0.3]
R12#5  Res1  value 330  [AXIAL-0.3]
R13#5  Res1  value 30k  [AXIAL-0.3]
R14#5  Res1  value 330  [AXIAL-0.3]
R15#5  Res1  value 7.5k  [AXIAL-0.3]
R16#5  Res1  value 11k  [AXIAL-0.3]
R17#5  Res1  value 330  [AXIAL-0.3]
R18#4  Res1  value 10k  [AXIAL-0.3]
R19#4  Res1  value 330  [AXIAL-0.3]
R20#4  Res1  value 330  [AXIAL-0.3]
R21#4  Res1  value 11k  [AXIAL-0.3]
R22#4  Res1  value 330  [AXIAL-0.3]
R23#3  Res1  value 10k  [AXIAL-0.3]
R24#2  Res1  value 11k  [AXIAL-0.3]
R25#2  Res1  value 11k  [AXIAL-0.3]
R26#2  Res1  value 330  [AXIAL-0.3]
R27#2  Res1  value 330  [AXIAL-0.3]
R28#2  Res1  value 10k  [AXIAL-0.3]
R29#2  Res1  value 330  [AXIAL-0.3]
R30#2  Res1  value 10k  [AXIAL-0.3]
R31#2  Res1  value 330  [AXIAL-0.3]
R32#2  Res1  value 330  [AXIAL-0.3]
S1  nintendo_power_reset  [PCBComponent_1]
U1#5  LM555CN  [N08E]
U2#5  SN7416N  [N014]  (parts A,B,C,D,E,F of 6)
U3#5  LM339N  [N14A]  (parts A,B,C,D of 4)
U4#5  SN7416N  [N014]  (parts A,B,C,D,E,F of 6)
U5#3  LM339N  [N14A]  (parts A,B,C of 4)
U6#2  SN7416N  [N014]  (parts A,B of 6)
VR1#3  L7812CP  [ISOWATT220AB]
VR2#2  L7805CP  [ISOWATT220AB]
VR3  L7805CP  [ISOWATT220AB]
VR4  L7812CP  [ISOWATT220AB]
VR5  L7805CP  [ISOWATT220AB]
VR6  L7812CP  [ISOWATT220AB]
VR7  L7805CP  [ISOWATT220AB]

### Nets
+24V: D1#5.1(A) D2#6.1(A) D7#5.1(A) D8#4.1(A) D10#3.1(A) D12#1.1(A) D14.1(A) R4#6.1 R7#5.1 R8#5.1 R13#5.1 R16#5.1 R21#4.1 R24#2.1 R25#2.1 S1.2(Power_out)
+24V_IN: P1#9.4 S1.1(Power_In)
DampVCC12: C1#5.1 C2#5.1 C2#5.2 C3#4.1 C3#4.2 C4#4.2 C5#3.1 C6#3.1 C6#3.2 C7#3.1 C7#3.2 C9#3.2 C10#2.1 C11#2.1 C12#2.1 C13#2.1 C14#2.1 C14#2.2 C15#2.1 C15#2.2 C16#2.1 C17#2.1 C18#2.1 C19#2.1 C20#2.1 C20#2.2 C21#2.1 C21#2.2 C22#2.1 C23#2.1 C23#2.2 C24#2.1 C24#2.2 D5#5.2(K) P1#9.2 P1#9.3 P2#11.1 P2#11.2 P2#11.3 P3#10.3 P5#8.1 P5#8.2 P6#5.2 P7#4.1 P7#4.2 P8#3.1 P8#3.2 P8#3.3 R3#6.2 R5#6.2 R6#5.2 R9#5.2 R11#5.2 R12#5.2 R14#5.2 R15#5.2 R17#5.2 R18#4.2 R19#4.2 R20#4.2 R22#4.2 R23#3.2 R26#2.2 R27#2.2 R28#2.2 R29#2.2 R30#2.2 R31#2.2 R32#2.2 S1.6(LED_out) S1.7(GND) S1.8(GND) U1#5.1(GND) U2#5.7(GND) U3#5.5(IN1+) U3#5.7(IN2+) U3#5.11(IN4+) U3#5.12(GND) U4#5.7(GND) U5#3.7(IN2+) U5#3.9(IN3+) U5#3.12(GND) U6#2.7(GND) VR1#3.2(OUT) VR1#3.3(GND) VR2#2.2(OUT) VR2#2.3(GND) VR3.3(GND) VR4.2(OUT) VR4.3(GND) VR5.3(GND) VR6.2(OUT) VR6.3(GND) VR7.2(OUT) VR7.3(GND)  [also labelled DampVCC5, GHVAC_VCC12, GND, TempVCC12, TempVCC5]
VCC: U2#5.14(VCC) U4#5.14(VCC) U6#2.14(VCC)
VCC-5: C9#3.1 D3#5.1(A) P3#10.2  [also labelled -5V]
MicVCC+5: C11#2.2 C12#2.2 P3#10.1 R1#6.1 U1#5.4(RST) U1#5.8(+VCC) U3#5.3(V+) U5#3.3(V+) U5#3.5(IN1+) VR3.2(OUT)
ResetIn: P4#8.1 S1.3(Reset_IN)
ResetOut: P4#8.2 S1.4(Reset_out)
WIFI_VCC5: C17#2.2 C18#2.2 P6#5.1 U3#5.9(IN3+) VR5.2(OUT)
NetC1#5_2: C1#5.2 D1#5.2(K) VR1#3.1(IN)
NetC4#4_1: C4#4.1 R2#7.2
NetC5#3_2: C5#3.2 D2#6.2(K) VR2#2.1(IN)
NetC8#3_1: C8#3.1 U1#5.3(OUT)
NetC8#3_2: C8#3.2 D3#5.2(K) D5#5.1(A)
NetC10#2_2: C10#2.2 D7#5.2(K) VR3.1(IN)
NetC13#2_2: C13#2.2 D8#4.2(K) VR4.1(IN)
NetC16#2_2: C16#2.2 D10#3.2(K) VR5.1(IN)
NetC19#2_2: C19#2.2 D12#1.2(K) VR6.1(IN)
NetC22#2_2: C22#2.2 D14.2(K) VR7.1(IN)
NetD4#5_1: D4#5.1(A) U2#5.2(Y) U2#5.3(A)
NetD4#5_2: D4#5.2(K) R3#6.1
NetD6#5_1: D6#5.1(A) U2#5.4(Y)
NetD6#5_2: D6#5.2(K) R6#5.1
NetD9#3_1: D9#3.1(A) U2#5.6(Y) U2#5.9(A)
NetD9#3_2: D9#3.2(K) R9#5.1
NetD11#2_1: D11#2.1(A) U2#5.8(Y)
NetD11#2_2: D11#2.2(K) R12#5.1
NetD13_1: D13.1(A) U2#5.10(Y) U4#5.1(A)
NetD13_2: D13.2(K) R14#5.1
NetD15_1: D15.1(A) U2#5.12(Y) U4#5.3(A)
NetD15_2: D15.2(K) R17#5.1
NetD16_1: D16.1(A) U4#5.2(Y)
NetD16_2: D16.2(K) R19#4.1
NetD17_1: D17.1(A) U4#5.4(Y)
NetD17_2: D17.2(K) R20#4.1
NetD18_1: D18.1(A) U4#5.6(Y) U4#5.9(A)
NetD18_2: D18.2(K) R22#4.1
NetD19_1: D19.1(A) U4#5.8(Y)
NetD19_2: D19.2(K) R26#2.1
NetD20_1: D20.1(A) U4#5.10(Y) U6#2.1(A)
NetD20_2: D20.2(K) R27#2.1
NetD21_1: D21.1(A) U4#5.12(Y) U6#2.3(A)
NetD21_2: D21.2(K) R29#2.1
NetD22_1: D22.1(A) U6#2.2(Y)
NetD22_2: D22.2(K) R31#2.1
NetD23_1: D23.1(A) U6#2.4(Y)
NetD23_2: D23.2(K) R32#2.1
NetR1#6_2: R1#6.2 R2#7.1 U1#5.7(DIS)
NetR4#6_2: R4#6.2 R5#6.1 U3#5.4(IN1-)
NetR7#5_2: R7#5.2 R11#5.1 U3#5.6(IN2-)
NetR8#5_2: R8#5.2 R10#5.1
NetR10#5_2: R10#5.2 S1.5(LED_IN)
NetR13#5_2: R13#5.2 R15#5.1 U3#5.8(IN3-)
NetR16#5_2: R16#5.2 R18#4.1 U3#5.10(IN4-)
NetR21#4_2: R21#4.2 R23#3.1 U5#3.4(IN1-)
NetR24#2_2: R24#2.2 R30#2.1 U5#3.8(IN3-)
NetR25#2_2: R25#2.2 R28#2.1 U5#3.6(IN2-)
NetU1#5_2: U1#5.2(TRIG) U1#5.6(THR)
NetU2#5_1: U2#5.1(A) U3#5.2(OUT1)
NetU2#5_5: U2#5.5(A) U3#5.1(OUT2)
NetU2#5_11: U2#5.11(A) U3#5.14(OUT3)
NetU2#5_13: U2#5.13(A) U3#5.13(OUT4)
NetU4#5_5: U4#5.5(A) U5#3.2(OUT1)
NetU4#5_11: U4#5.11(A) U5#3.1(OUT2)
NetU4#5_13: U4#5.13(A) U5#3.14(OUT3)

Not connected (* = marked no-connect by the designer): P1#9 1; U1#5 5(CVOLT)

### Notes on the sheet
- POWER SUPPLY BOARD
- Damper Board Power +5V and +12V
- (near P1#9) External 24V Power Supply
- Stephen Hobley had the design for using a 555 timer chip in astable
- Positive and negative 5V
- Mic Power Supply
- (near P1#9) NC
- to convert +5V to +/-5 V estimated amount of current 10ma. enough for mic signals.
- Voltage good = Green LED on
- Voltage bad = Red LED on
- NC
- 12V test is if the voltage is greater than 11.42V
- 5V test is if the voltage is greater than 4.8V
- (near P3#10) To go to Mic board
- Test Damper Voltage
- Garage and HVAC power
- (near S1) Super Nintendo Power/Reset Button
- WIRELESS Power
- Temperature Sensor Power
- (near C21#2) To go to the Temperature Sensor Board
- Test WIFI 5V power
- tie main and power
- Test Temperature 5V & 12V power
- Test Mic +5V power
- (near U5#3) Test Garage and HVAC 12V
- Date:
- Time:
- Engineer:
- Drawn By:
- Checked By:
- Title
- Size:
- File:
- B
- Number:
- Revision:
- Project:
- Sheet
- of
- Website:

### Library data of the parts
C1#5 C2#5 C3#4 C4#4 C5#3 C6#3 C7#3 C8#3 C9#3 C10#2 C11#2 C12#2 C13#2 C14#2 C15#2 C16#2 C17#2 C18#2 C19#2 C20#2 C21#2 C22#2 C23#2 C24#2 = Cap: Capacitor; Vendor: Taydaelectronics; Published: 8-Jun-2000; LatestRevisionDate: 17-Jul-2002; LatestRevisionNote: Re-released for DXP Platform.; PackageReference: RAD-0.3; Publisher: Altium Limited; PackageDescription: Radial Cap, Thru-Hole; 2 Leads; 0.3 in Pin Spacing; Price: 0.03
D1#5 D2#6 D7#5 D8#4 D10#3 D12#1 D14 = Diode 1N4001: 1 Amp General Purpose Rectifier; Vendor: Taydaelectronics; Published: 8-Jun-2000; LatestRevisionDate: 17-Jul-2002; LatestRevisionNote: Re-released for DXP Platform.; DatasheetVersion: 1998; PackageVersion: Aug-1999; PackageReference: DO-41; Publisher: Altium Limited; PackageDescription: Diode, Axial; Body 5.2 x 2.7 mm (LxDia. max), Lead Dia. 0.86 mm (max); Code_JEDEC: DO-204-AL; ComponentLink1URL: http://www.fairchildsemi.com/; ComponentLink2Description: Datasheet; ComponentLink2URL: http://www.fairchildsemi.com/ds/1N%2F1N4001.pdf; Price: 0.01; Value: 1N4001
D3#5 D5#5 = Diode 1N4148: High Conductance Fast Diode; Vendor: Taydaelectronics; Published: 8-Jun-2000; LatestRevisionDate: 17-Jul-2002; LatestRevisionNote: Re-released for DXP Platform.; DatasheetVersion: 1997; PackageReference: DO-35; Publisher: Altium Limited; PackageDescription: Diode, Axial; Body 3.8 x 1.9 mm (LxDia. max), Lead Dia. 0.53 mm (max); Code_JEDEC: DO-204-AH; ComponentLink1URL: http://www.fairchildsemi.com/; ComponentLink2Description: Datasheet; ComponentLink2URL: http://www.fairchildsemi.com/ds/1N%2F1N4148.pdf; Price: 0.01; Value: Diode 1N4148
D4#5 D6#5 D9#3 D11#2 D13 D15-D23 = LED0: Typical INFRARED GaAs LED; Vendor: Taydaelectronics; Value: LED0; Published: 8-Jun-2000; LatestRevisionDate: 08-Jul-2005; LatestRevisionNote: Mech Layer 1 removed.; PackageReference: LED-0; Publisher: Altium Limited; PackageDescription: LED; 2 Leads; Price: 0.04
P1#9 = Header 4: Header, 4-Pin; Vendor: Taydaelectronics; LatestRevisionDate: 17-Jul-2002; LatestRevisionNote: Re-released for DXP Platform.; Publisher: Altium Limited; Price: 0.04; Value: Header 4
P2#11 P3#10 P8#3 = Header 3: Header, 3-Pin; Vendor: Taydaelectronics; LatestRevisionDate: 17-Jul-2002; LatestRevisionNote: Re-released for DXP Platform.; Publisher: Altium Limited; Price: 0.03; Value: Header 3
P4#8 P5#8 P6#5 P7#4 = Header 2: Header, 2-Pin; Vendor: Taydaelectronics; LatestRevisionDate: 17-Jul-2002; LatestRevisionNote: Re-released for DXP Platform.; Publisher: Altium Limited; Price: 0.02; Value: Header 2
R1#6 R2#7 R3#6 R4#6 R5#6 R6#5 R7#5 R8#5 R9#5 R10#5 R11#5 R12#5 R13#5 R14#5 R15#5 R16#5 R17#5 R18#4 R19#4 R20#4 R21#4 R22#4 R23#3 R24#2 R25#2 R26#2 R27#2 R28#2 R29#2 R30#2 R31#2 R32#2 = Res1: Resistor; Vendor: Taydaelectronics; Published: 8-Jun-2000; LatestRevisionDate: 17-Jul-2002; LatestRevisionNote: Re-released for DXP Platform.; PackageReference: AXIAL-0.3; Publisher: Altium Limited; PackageDescription: Axial Device, Thru-Hole; 2 Leads; 0.3 in Pin Spacing; Price: 0.01
S1 = nintendo_power_reset: Vendor: All Electronics; Price: 1.0; Value: nintendo_power_reset
U1#5 = LM555CN: Timer; Manufacturer: National Semiconductor; CompType: Analog IC; PackageTopMarking: NSUZXYTT*LM*555CN; PowerWise: N; Vendor: Taydaelectronics; Published: 4-Dec-2008; DatasheetVersion: Jul-2006; PackageVersion: revG, May-2006; PackageReference: N08E; Publisher: Altium Limited; PackageDescription: MDIP, .365 x .250 x .130in, 8 Lead, .100in Pitch; PartNumber: LM555CN; PinCount: 8; DigiKeyPartNumber: LM555CNNS-ND; Code_JEDEC: MS-001-BA; ComponentLink1URL: http://www.national.com/ds.cgi/LM/LM555.pdf; ComponentLink2Description: LM555 Web Page; ComponentLink2URL: http://www.national.com/pf/LM/LM555.html; ComponentLink3Description: N08E package page; ComponentLink3URL: http://www.national.com/packaging/folders/n08e.html; Price: 0.14; Value: LM555CN
U2#5 U4#5 U6#2 = SN7416N: Hex Inverter Buffer / Driver with High-Voltage Outputs; Vendor: Taydaelectronics; Published: 8-Jun-2000; LatestRevisionDate: 04-Mar-2005; LatestRevisionNote: Stylized 3D Model Added.; DatasheetVersion: Mar-1988; PackageVersion: Oct-1995; PackageReference: N014; Publisher: Altium Limited; PackageDescription: DIP; 14 Leads; Row Spacing 7.62 mm; Pitch 2.54 mm; ComponentLink1URL: http://www.ti.com/; ComponentLink2Description: Datasheet; ComponentLink2URL: http://www-s.ti.com/sc/ds/sn5416.pdf; ComponentLink3Description: Packaging Specification; ComponentLink3URL: http://focus.ti.com/lit/ml/mpdi002c/mpdi002c.pdf; Price: 0.18; Value: SN7416N
U3#5 U5#3 = LM339N: Low Power Low Offset Voltage Quad Comparator; Manufacturer: National Semiconductor; CompType: Amplifiers; PackageTopMarking: NSUZXYYTTE#*LM339N; PowerWise: N; Vendor: Taydaelectronics; Published: 4-Dec-2008; DatasheetVersion: Mar-2004; PackageVersion: revG, May-2006; PackageReference: N14A; Publisher: Altium Limited; PackageDescription: MDIP, .750 x .250 x.130in, 14 Lead, .100in Pitch; PartNumber: LM339N; RoHS: O; PinCount: 14; DigiKeyPartNumber: LM339NNS-ND; Code_JEDEC: MS-001-AA; ComponentLink1URL: http://www.national.com/ds/LM/LM339.pdf; ComponentLink2Description: LM339 Web Page; ComponentLink2URL: http://www.national.com/pf/LM/LM339.html; ComponentLink3Description: N14A Package Page; ComponentLink3URL: http://www.national.com/packaging/folders/n14a.html; Price: 0.17; Value: LM339N
VR1#3 VR2#2 VR3-VR7 = L7805CP: Positive Voltage Regulator; Note: Tab is connected to pin 3 (GND).; Vendor: Taydaelectronics; Published: 24-Aug-2001; LatestRevisionDate: 17-Jul-2002; LatestRevisionNote: Re-released for DXP Platform.; DatasheetVersion: Dec-1998; PackageVersion: Jul-1998; PackageReference: ISOWATT220AB; Publisher: Altium Limited; PackageDescription: TO, Thru-Hole, Vertical, Heatsink Mounted; 3 In-Line Leads; Pitch 2.54 mm; Pin sequence 1, 3, 2; ComponentLink1URL: http://www.st.com/; Price: 0.24
  VR1#3 VR4 VR6: Value: L7812CP
  VR2#2 VR3 VR5 VR7: Value: L7805CP

## Sheet SpeakerMixer.SchDoc: Speaker Mixer
size B; Author: Levi Balling; CompanyName: Smart Home; DrawnBy: Levi Balling; Engineer: Levi Balling; Organization: U of U Computer Engineering; Address1: 50 S. Central Campus Dr.; Address2: Rm. 3280 MEB; Address3: Salt Lake City, UT; Address4: Australia 2086; DocumentNumber: 1; Revision: 1; SheetNumber: 13; SheetTotal: 13; Website: www.eng.utah.edu/~lballing/SmartHome; Project: Smart Home; ProjectName: Smart Home
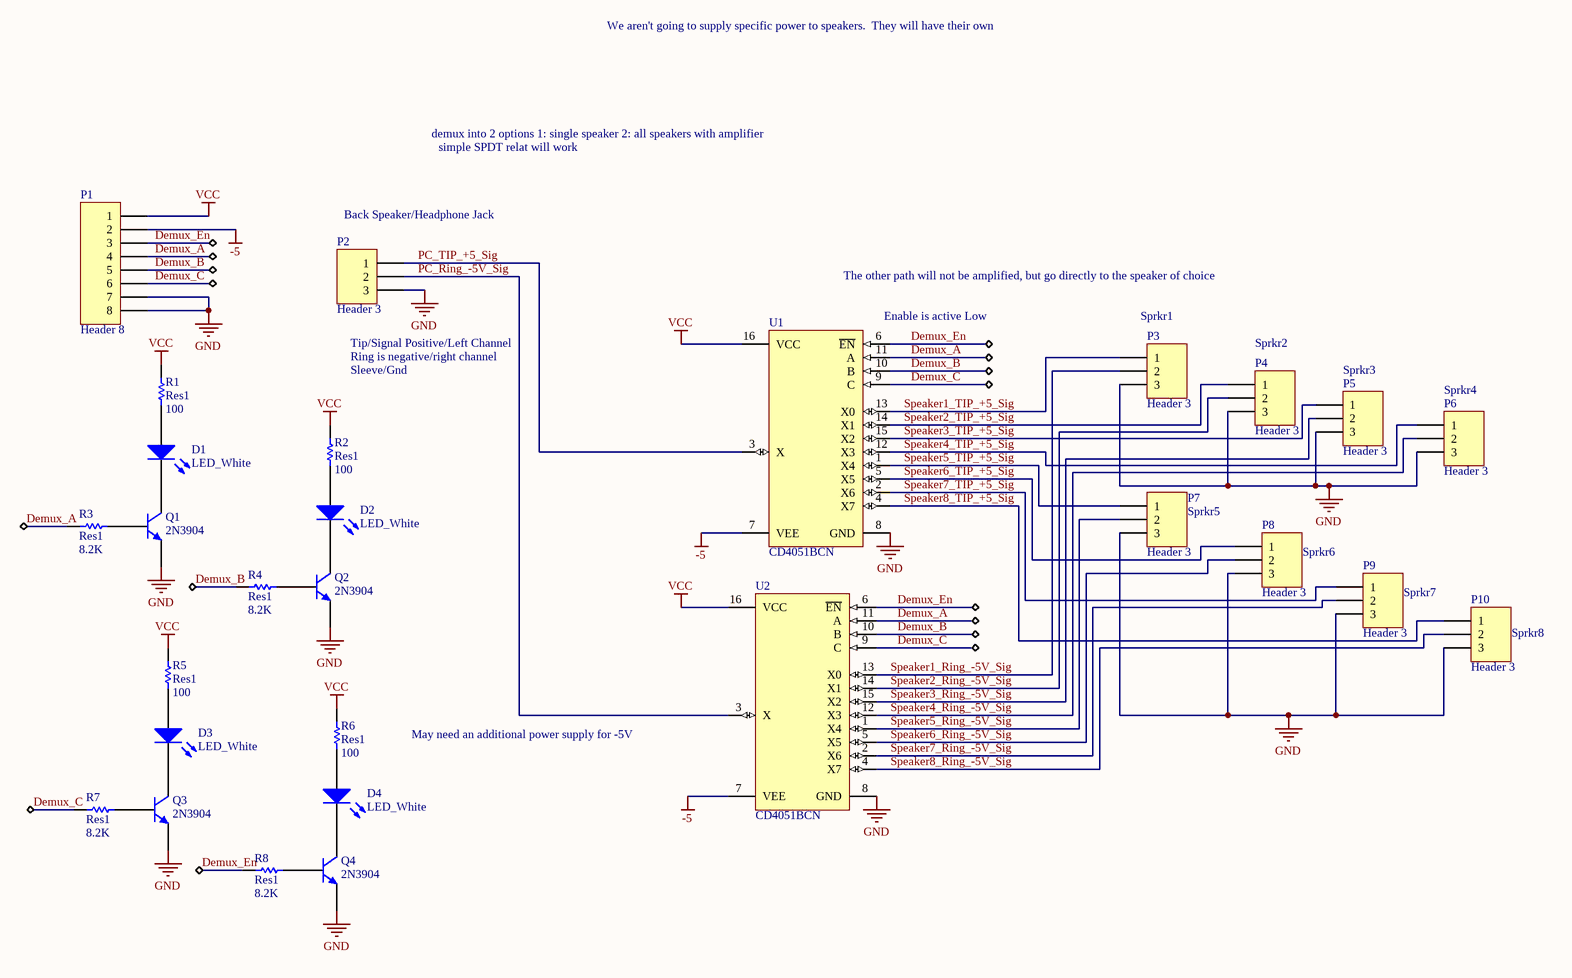
[diagram p8: SpeakerMixer.SchDoc]

### Parts
(Parts that share a designator on the sheet are numbered #1, #2 ... from top to bottom, then left to right.)
D1#6  LED_White  [LED]
D2#7  LED_White  [LED]
D3#6  LED_White  [LED]
D4#6  LED_White  [LED]
P1#10  Header 8  [HDR1X8]
P2#12  Header 3  [HDR1X3]
P3#11  Header 3  [HDR1X3]
P4#9  Header 3  [HDR1X3]
P5#9  Header 3  [HDR1X3]
P6#6  Header 3  [HDR1X3]
P7#5  Header 3  [HDR1X3]
P8#4  Header 3  [HDR1X3]
P9#3  Header 3  [HDR1X3]
P10#4  Header 3  [HDR1X3]
Q1#6  2N3904  [2N3904]
Q2#6  2N3904  [2N3904]
Q3#6  2N3904  [2N3904]
Q4#6  2N3904  [2N3904]
R1#7  Res1  value 100  [AXIAL-0.3]
R2#8  Res1  value 100  [AXIAL-0.3]
R3#7  Res1  value 8.2K  [AXIAL-0.3]
R4#7  Res1  value 8.2K  [AXIAL-0.3]
R5#7  Res1  value 100  [AXIAL-0.3]
R6#6  Res1  value 100  [AXIAL-0.3]
R7#6  Res1  value 8.2K  [AXIAL-0.3]
R8#6  Res1  value 8.2K  [AXIAL-0.3]
U1#6  CD4051BCN  [N16E]
U2#6  CD4051BCN  [N16E]

### Nets
-5: P1#10.2 U1#6.7(VEE) U2#6.7(VEE)
GND: P1#10.7 P1#10.8 P2#12.3 P3#11.3 P4#9.3 P5#9.3 P6#6.3 P7#5.3 P8#4.3 P9#3.3 P10#4.3 Q1#6.1(E) Q2#6.1(E) Q3#6.1(E) Q4#6.1(E) U1#6.8(GND) U2#6.8(GND)  [project net DampVCC12]
VCC: P1#10.1 R1#7.1 R2#8.1 R5#7.1 R6#6.1 U1#6.16(VCC) U2#6.16(VCC)
Demux_A: P1#10.4 R3#7.1 U1#6.11(A) U2#6.11(A)
Demux_B: P1#10.5 R4#7.1 U1#6.10(B) U2#6.10(B)
Demux_C: P1#10.6 R7#6.1 U1#6.9(C) U2#6.9(C)
Demux_En: P1#10.3 R8#6.1 U1#6.6(~{EN}) U2#6.6(~{EN})
PC_Ring_-5V_Sig: P2#12.2 U2#6.3(X)
PC_TIP_+5_Sig: P2#12.1 U1#6.3(X)
Speaker1_Ring_-5V_Sig: P3#11.2 U2#6.13(X0)
Speaker1_TIP_+5_Sig: P3#11.1 U1#6.13(X0)
Speaker2_Ring_-5V_Sig: P4#9.2 U2#6.14(X1)
Speaker2_TIP_+5_Sig: P4#9.1 U1#6.14(X1)
Speaker3_Ring_-5V_Sig: P5#9.2 U2#6.15(X2)
Speaker3_TIP_+5_Sig: P5#9.1 U1#6.15(X2)
Speaker4_Ring_-5V_Sig: P6#6.2 U2#6.12(X3)
Speaker4_TIP_+5_Sig: P6#6.1 U1#6.12(X3)
Speaker5_Ring_-5V_Sig: P7#5.2 U2#6.1(X4)
Speaker5_TIP_+5_Sig: P7#5.1 U1#6.1(X4)
Speaker6_Ring_-5V_Sig: P8#4.2 U2#6.5(X5)
Speaker6_TIP_+5_Sig: P8#4.1 U1#6.5(X5)
Speaker7_Ring_-5V_Sig: P9#3.2 U2#6.2(X6)
Speaker7_TIP_+5_Sig: P9#3.1 U1#6.2(X6)
Speaker8_Ring_-5V_Sig: P10#4.2 U2#6.4(X7)
Speaker8_TIP_+5_Sig: P10#4.1 U1#6.4(X7)
NetD1#6_1: D1#6.1(A) R1#7.2
NetD1#6_2: D1#6.2(K) Q1#6.3(C)
NetD2#7_1: D2#7.1(A) R2#8.2
NetD2#7_2: D2#7.2(K) Q2#6.3(C)
NetD3#6_1: D3#6.1(A) R5#7.2
NetD3#6_2: D3#6.2(K) Q3#6.3(C)
NetD4#6_1: D4#6.1(A) R6#6.2
NetD4#6_2: D4#6.2(K) Q4#6.3(C)
NetQ1#6_2: Q1#6.2(B) R3#7.2
NetQ2#6_2: Q2#6.2(B) R4#7.2
NetQ3#6_2: Q3#6.2(B) R7#6.2
NetQ4#6_2: Q4#6.2(B) R8#6.2

### Notes on the sheet
- We aren't going to supply specific power to speakers.  They will have their own
- demux into 2 options 1: single speaker 2: all speakers with amplifier
- simple SPDT relat will work
- (near P2#12) Back Speaker/Headphone Jack
- The other path will not be amplified, but go directly to the speaker of choice
- (near U1#6) Enable is active Low
- (near P3#11) Sprkr1
- (near P2#12) Tip/Signal Positive/Left Channel
- Ring is negative/right channel
- Sleeve/Gnd
- (near P4#9) Sprkr2
- (near P5#9) Sprkr3
- (near P6#6) Sprkr4
- Sprkr5
- Sprkr6
- Sprkr7
- (near P10#4) Sprkr8
- May need an additional power supply for -5V
- Date:
- Time:
- Engineer:
- Drawn By:
- Checked By:
- Title
- Size:
- File:
- B
- Number:
- Revision:
- Project:
- Sheet
- of
- Website:

### Library data of the parts
D1#6 D2#7 D3#6 D4#6 = LED0: as D4#5 on sheet PowerAndFanBoard; Published: 8-Jun-2000; LatestRevisionDate: 08-Jul-2005; LatestRevisionNote: Mech Layer 1 removed.; PackageReference: LED-0; Publisher: Altium Limited; PackageDescription: LED; 2 Leads; Price: 0.04
P1#10 = Header 8: Header, 8-Pin; Vendor: Taydaelectronics; LatestRevisionDate: 17-Jul-2002; LatestRevisionNote: Re-released for DXP Platform.; Publisher: Altium Limited; Price: 0.08; Value: Header 8
P2#12 P3#11 P4#9 P5#9 P6#6 P7#5 P8#4 P9#3 P10#4 = Header 3: Header, 3-Pin; Vendor: Taydaelectronics; LatestRevisionDate: 17-Jul-2002; LatestRevisionNote: Re-released for DXP Platform.; Publisher: Altium Limited; Price: 0.03; Value: Header 3
Q1#6 Q2#6 Q3#6 Q4#6 = 2N3904: NPN General Purpose Amplifier; Vendor: Taydaelectronics; Published: 8-Jun-2000; LatestRevisionDate: 15-Jan-2003; LatestRevisionNote: PCB Footprint 'BCY-W3/D4.7' replaced; DatasheetVersion: 1997; PackageVersion: Sep-1998; PackageReference: TO-92A; Publisher: Altium Limited; PackageDescription: TO, Flat Index; 3 In-Line, Axial Leads; Body Dia. 4.5mm; Leads 0.51 x 0.48 mm (max); ComponentLink1URL: http://www.fairchildsemi.com/; ComponentLink2Description: Datasheet; ComponentLink2URL: http://www.fairchildsemi.com/ds/2N%2F2N3904.pdf; Price: 0.01; Value: 2N3904
R1#7 R2#8 R3#7 R4#7 R5#7 R6#6 R7#6 R8#6 = Res1: Resistor; Vendor: Taydaelectronics; Published: 8-Jun-2000; LatestRevisionDate: 17-Jul-2002; LatestRevisionNote: Re-released for DXP Platform.; PackageReference: AXIAL-0.3; Publisher: Altium Limited; PackageDescription: Axial Device, Thru-Hole; 2 Leads; 0.3 in Pin Spacing; Price: 0.01
U1#6 U2#6 = CD4051BCN: 8-Channel Analog Multiplexer/Demultiplexer; Vendor: Taydaelectronics; Published: 17-Jul-2002; LatestRevisionDate: 29-May-2009; LatestRevisionNote: Component Body Added.; DatasheetVersion: Jan-1999; PackageVersion: 2000; PackageReference: N16E; Publisher: Altium Limited; PackageDescription: DIP, 16-Pin, Row Spacing 7.62 mm, Pitch 2.54 mm; ComponentLink1URL: http://www.fairchildsemi.com/; ComponentLink2Description: Datasheet; ComponentLink2URL: http://www.fairchildsemi.com/ds/CD%2FCD4052BC.pdf; Price: 0.23; Value: CD4051BCN

## Sheet SprinklerBoard.SchDoc: Sprinkler Controller
size B; DrawnBy: Levi Balling; Engineer: Levi Balling; Organization: U of U Computer Engineering; Address1: 50 S. Central Campus Dr.; Address2: Rm. 3280 MEB; Address3: Salt Lake City, UT; Address4: Australia 2086; DocumentNumber: 1; Revision: 1; SheetNumber: 9; SheetTotal: 13; Website: www.eng.utah.edu/~lballing/SmartHome; Project: Smart Home; Description: This board will control 6 Sprinkler Stations; ProjectName: Smart Home
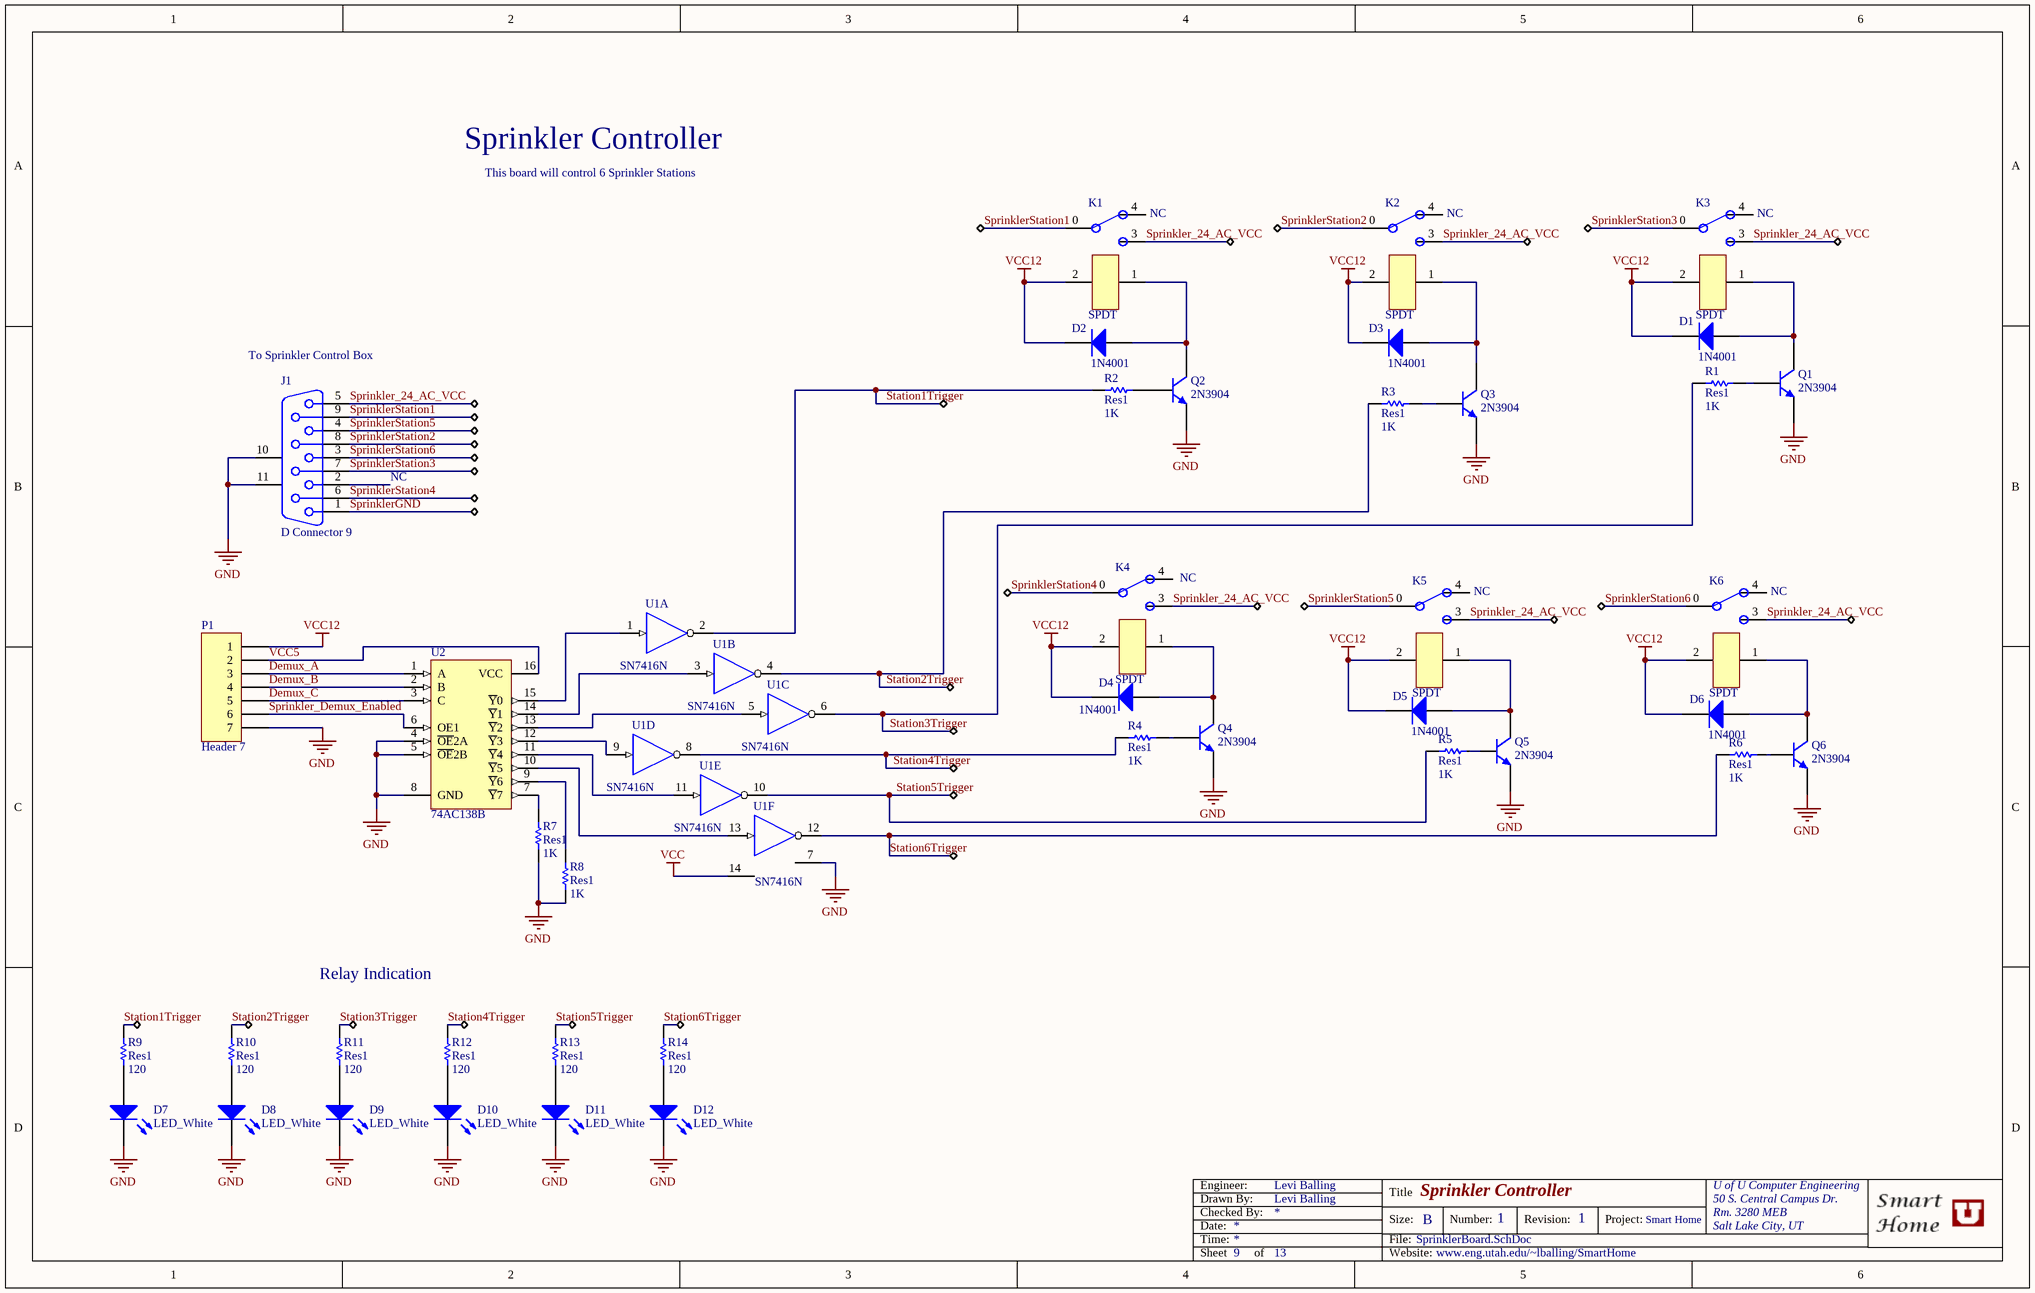
[diagram p9: SprinklerBoard.SchDoc]

### Parts
(Parts that share a designator on the sheet are numbered #1, #2 ... from top to bottom, then left to right.)
D1#7  1N4001  [DO-41]
D2#8  1N4001  [DO-41]
D3#7  1N4001  [DO-41]
D4#7  1N4001  [DO-41]
D5#6  1N4001  [DO-41]
D6#6  1N4001  [DO-41]
D7#6  LED_White  [LED]
D8#5  LED_White  [LED]
D9#4  LED_White  [LED]
D10#4  LED_White  [LED]
D11#3  LED_White  [LED]
D12#2  LED_White  [LED]
J1#4  D Connector 9  [DSUB1.385-2H9]
K1#3  SPDT  [Relay  SPDT Tayda]
K2#3  SPDT  [Relay  SPDT Tayda]
K3#3  SPDT  [Relay  SPDT Tayda]
K4#3  SPDT  [Relay  SPDT Tayda]
K5#3  SPDT  [Relay  SPDT Tayda]
K6#3  SPDT  [Relay  SPDT Tayda]
P1#11  Header 7  [HDR1X7]
Q1#7  2N3904  [2N3904]
Q2#7  2N3904  [2N3904]
Q3#7  2N3904  [2N3904]
Q4#7  2N3904  [2N3904]
Q5#5  2N3904  [2N3904]
Q6#4  2N3904  [2N3904]
R1#8  Res1  value 1K  [AXIAL-0.3]
R2#9  Res1  value 1K  [AXIAL-0.3]
R3#8  Res1  value 1K  [AXIAL-0.3]
R4#8  Res1  value 1K  [AXIAL-0.3]
R5#8  Res1  value 1K  [AXIAL-0.3]
R6#7  Res1  value 1K  [AXIAL-0.3]
R7#7  Res1  value 1K  [AXIAL-0.3]
R8#7  Res1  value 1K  [AXIAL-0.3]
R9#6  Res1  value 120  [AXIAL-0.3]
R10#6  Res1  value 120  [AXIAL-0.3]
R11#6  Res1  value 120  [AXIAL-0.3]
R12#6  Res1  value 120  [AXIAL-0.3]
R13#6  Res1  value 120  [AXIAL-0.3]
R14#6  Res1  value 120  [AXIAL-0.3]
U1#7  SN7416N  [N014]  (parts A,B,C,D,E,F of 6)
U2#7  74AC138B  [DIP16]

### Nets
GND: D7#6.2(K) D8#5.2(K) D9#4.2(K) D10#4.2(K) D11#3.2(K) D12#2.2(K) J1#4.10(MH1) J1#4.11(MH2) P1#11.7 Q1#7.1(E) Q2#7.1(E) Q3#7.1(E) Q4#7.1(E) Q5#5.1(E) Q6#4.1(E) R7#7.1 R8#7.1 U1#7.7(GND) U2#7.4(~{OE}2A) U2#7.5(~{OE}2B) U2#7.8(GND)  [project net DampVCC12]
VCC: U1#7.14(VCC)
VCC12: D1#7.2(K) D2#8.2(K) D3#7.2(K) D4#7.2(K) D5#6.2(K) D6#6.2(K) K1#3.2 K2#3.2 K3#3.2 K4#3.2 K5#3.2 K6#3.2 P1#11.1
Demux_A: P1#11.3 U2#7.1(A)
Demux_B: P1#11.4 U2#7.2(B)
Demux_C: P1#11.5 U2#7.3(C)
Sprinkler_24_AC_VCC: J1#4.5 K1#3.3 K2#3.3 K3#3.3 K4#3.3 K5#3.3 K6#3.3
Sprinkler_Demux_Enabled: P1#11.6 U2#7.6(OE1)
SprinklerGND: J1#4.1
SprinklerStation1: J1#4.9 K1#3.0
SprinklerStation2: J1#4.8 K2#3.0
SprinklerStation3: J1#4.7 K3#3.0
SprinklerStation4: J1#4.6 K4#3.0
SprinklerStation5: J1#4.4 K5#3.0
SprinklerStation6: J1#4.3 K6#3.0
Station1Trigger: R2#9.2 R9#6.1 U1#7.2(Y)
Station2Trigger: R3#8.2 R10#6.1 U1#7.4(Y)
Station3Trigger: R1#8.2 R11#6.1 U1#7.6(Y)
Station4Trigger: R4#8.2 R12#6.1 U1#7.8(Y)
Station5Trigger: R5#8.2 R13#6.1 U1#7.10(Y)
Station6Trigger: R6#7.2 R14#6.1 U1#7.12(Y)
VCC5: P1#11.2 U2#7.16(VCC)
NetD1#7_1: D1#7.1(A) K3#3.1 Q1#7.3(C)
NetD2#8_1: D2#8.1(A) K1#3.1 Q2#7.3(C)
NetD3#7_1: D3#7.1(A) K2#3.1 Q3#7.3(C)
NetD4#7_1: D4#7.1(A) K4#3.1 Q4#7.3(C)
NetD5#6_1: D5#6.1(A) K5#3.1 Q5#5.3(C)
NetD6#6_1: D6#6.1(A) K6#3.1 Q6#4.3(C)
NetD7#6_1: D7#6.1(A) R9#6.2
NetD8#5_1: D8#5.1(A) R10#6.2
NetD9#4_1: D9#4.1(A) R11#6.2
NetD10#4_1: D10#4.1(A) R12#6.2
NetD11#3_1: D11#3.1(A) R13#6.2
NetD12#2_1: D12#2.1(A) R14#6.2
NetQ1#7_2: Q1#7.2(B) R1#8.1
NetQ2#7_2: Q2#7.2(B) R2#9.1
NetQ3#7_2: Q3#7.2(B) R3#8.1
NetQ4#7_2: Q4#7.2(B) R4#8.1
NetQ5#5_2: Q5#5.2(B) R5#8.1
NetQ6#4_2: Q6#4.2(B) R6#7.1
NetR7#7_2: R7#7.2 U2#7.7(~{Y}7)
NetR8#7_2: R8#7.2 U2#7.9(~{Y}6)
NetU1#7_1: U1#7.1(A) U2#7.15(~{Y}0)
NetU1#7_3: U1#7.3(A) U2#7.14(~{Y}1)
NetU1#7_5: U1#7.5(A) U2#7.13(~{Y}2)
NetU1#7_9: U1#7.9(A) U2#7.12(~{Y}3)
NetU1#7_11: U1#7.11(A) U2#7.11(~{Y}4)
NetU1#7_13: U1#7.13(A) U2#7.10(~{Y}5)

Not connected (* = marked no-connect by the designer): J1#4 2; K1#3 4; K2#3 4; K3#3 4; K4#3 4; K5#3 4; K6#3 4

### Notes on the sheet
- (near K1#3) NC
- (near K2#3) NC
- (near K3#3) NC
- (near J1#4) To Sprinkler Control Box
- NC
- (near K4#3) NC
- (near K5#3) NC
- (near K6#3) NC
- Relay Indication
- Date:
- Time:
- Engineer:
- Drawn By:
- Checked By:
- Title
- Size:
- File:
- B
- Number:
- Revision:
- Project:
- Sheet
- of
- Website:

### Library data of the parts
D1#7 D2#8 D3#7 D4#7 D5#6 D6#6 = 1N4001: 1.0 Ampere General Purpose Rectifier; Vendor: Taydaelectronics; Published: 8-Jun-2000; LatestRevisionDate: 17-Jul-2002; LatestRevisionNote: Re-released for DXP Platform.; DatasheetDocument: 1998; PackageDocument: Aug-1999; PackageReference: DO-41; Publisher: Altium Limited; Code_JEDEC: DO-204-AL; ComponentLink1Description: Manufacturer Link; ComponentLink1URL: http://www.fairchildsemi.com/; ComponentLink2Description: Pinout Specification; ComponentLink2URL: http://www.fairchildsemi.com/ds/1N%2F1N4001.pdf; Price: 0.01; Value: 1N4001
D7#6 D8#5 D9#4 D10#4 D11#3 D12#2 = LED0: as D4#5 on sheet PowerAndFanBoard; Published: 8-Jun-2000; LatestRevisionDate: 08-Jul-2005; LatestRevisionNote: Mech Layer 1 removed.; PackageReference: LED-0; Publisher: Altium Limited; PackageDescription: LED; 2 Leads; Price: 0.04
J1#4 = D Connector 9: Receptacle Assembly, 9 Position, Right Angle; PackageDocument: O; Positions: 9; Vendor: Taydaelectronics; Published: 15-Jun-2001; LatestRevisionDate: 17-Jul-2002; LatestRevisionNote: Re-released for DXP Platform.; DatasheetDocument: 1-Sep-1999; PackageReference: 788750; Publisher: Altium Limited; Orientation: Right Angle; Gender: Receptacle; Price: 0.48; Value: D Connector 9
K1#3 K2#3 K3#3 K4#3 K5#3 K6#3 = SPDT: Vendor: Taydaelectronics; Price: 0.64; Value: SPDT
P1#11 = Header 7: Header, 7-Pin; Vendor: Taydaelectronics; LatestRevisionDate: 17-Jul-2002; LatestRevisionNote: Re-released for DXP Platform.; Publisher: Altium Limited; Price: 0.07; Value: Header 7
Q1#7 Q2#7 Q3#7 Q4#7 Q5#5 Q6#4 = 2N3904: as Q1#6 on sheet SpeakerMixer; Published: 8-Jun-2000; LatestRevisionDate: 15-Jan-2003; LatestRevisionNote: PCB Footprint 'BCY-W3/D4.7' replaced; DatasheetVersion: 1997; PackageVersion: Sep-1998; PackageReference: TO-92A; Publisher: Altium Limited; PackageDescription: TO, Flat Index; 3 In-Line, Axial Leads; Body Dia. 4.5mm; Leads 0.51 x 0.48 mm (max); ComponentLink1URL: http://www.fairchildsemi.com/; ComponentLink2Description: Datasheet; ComponentLink2URL: http://www.fairchildsemi.com/ds/2N%2F2N3904.pdf; Price: 0.01; Value: 2N3904
R1#8 R2#9 R3#8 R4#8 R5#8 R6#7 R7#7 R8#7 R9#6 R10#6 R11#6 R12#6 R13#6 R14#6 = Res1: Resistor; Vendor: Taydaelectronics; Published: 8-Jun-2000; LatestRevisionDate: 17-Jul-2002; LatestRevisionNote: Re-released for DXP Platform.; PackageReference: AXIAL-0.3; Publisher: Altium Limited; PackageDescription: Axial Device, Thru-Hole; 2 Leads; 0.3 in Pin Spacing; Price: 0.01
U1#7 = SN7416N: as U2#5 on sheet PowerAndFanBoard; Published: 8-Jun-2000; LatestRevisionDate: 04-Mar-2005; LatestRevisionNote: Stylized 3D Model Added.; DatasheetVersion: Mar-1988; PackageVersion: Oct-1995; PackageReference: N014; Publisher: Altium Limited; PackageDescription: DIP; 14 Leads; Row Spacing 7.62 mm; Pitch 2.54 mm; ComponentLink1URL: http://www.ti.com/; ComponentLink2Description: Datasheet; ComponentLink2URL: http://www-s.ti.com/sc/ds/sn5416.pdf; ComponentLink3Description: Packaging Specification; ComponentLink3URL: http://focus.ti.com/lit/ml/mpdi002c/mpdi002c.pdf; Price: 0.18; Value: SN7416N
U2#7 = 74AC138B: 3-to-8 Line Decoder Inverting; Vendor: Taydaelectronics; Published: 8-Jun-2000; LatestRevisionDate: 06-Jun-2005; LatestRevisionNote: Stylized 3D Model Added.; DatasheetVersion: Apr-1997; PackageVersion: Apr-1996; PackageReference: DIP16; Publisher: Altium Limited; PackageDescription: DIP; 16 Leads; Row Spacing 7.62 mm; Pitch 2.54 mm; ComponentLink1URL: http://www.st.com/; ComponentLink2Description: Datasheet; ComponentLink2URL: http://www.st.com/stonline/products/literature/ds/4696/74ac138.pdf; Price: 0.25; Value: 74AC138B